# EAGLE design Nixie Radio (EAGLE 9.6.2)
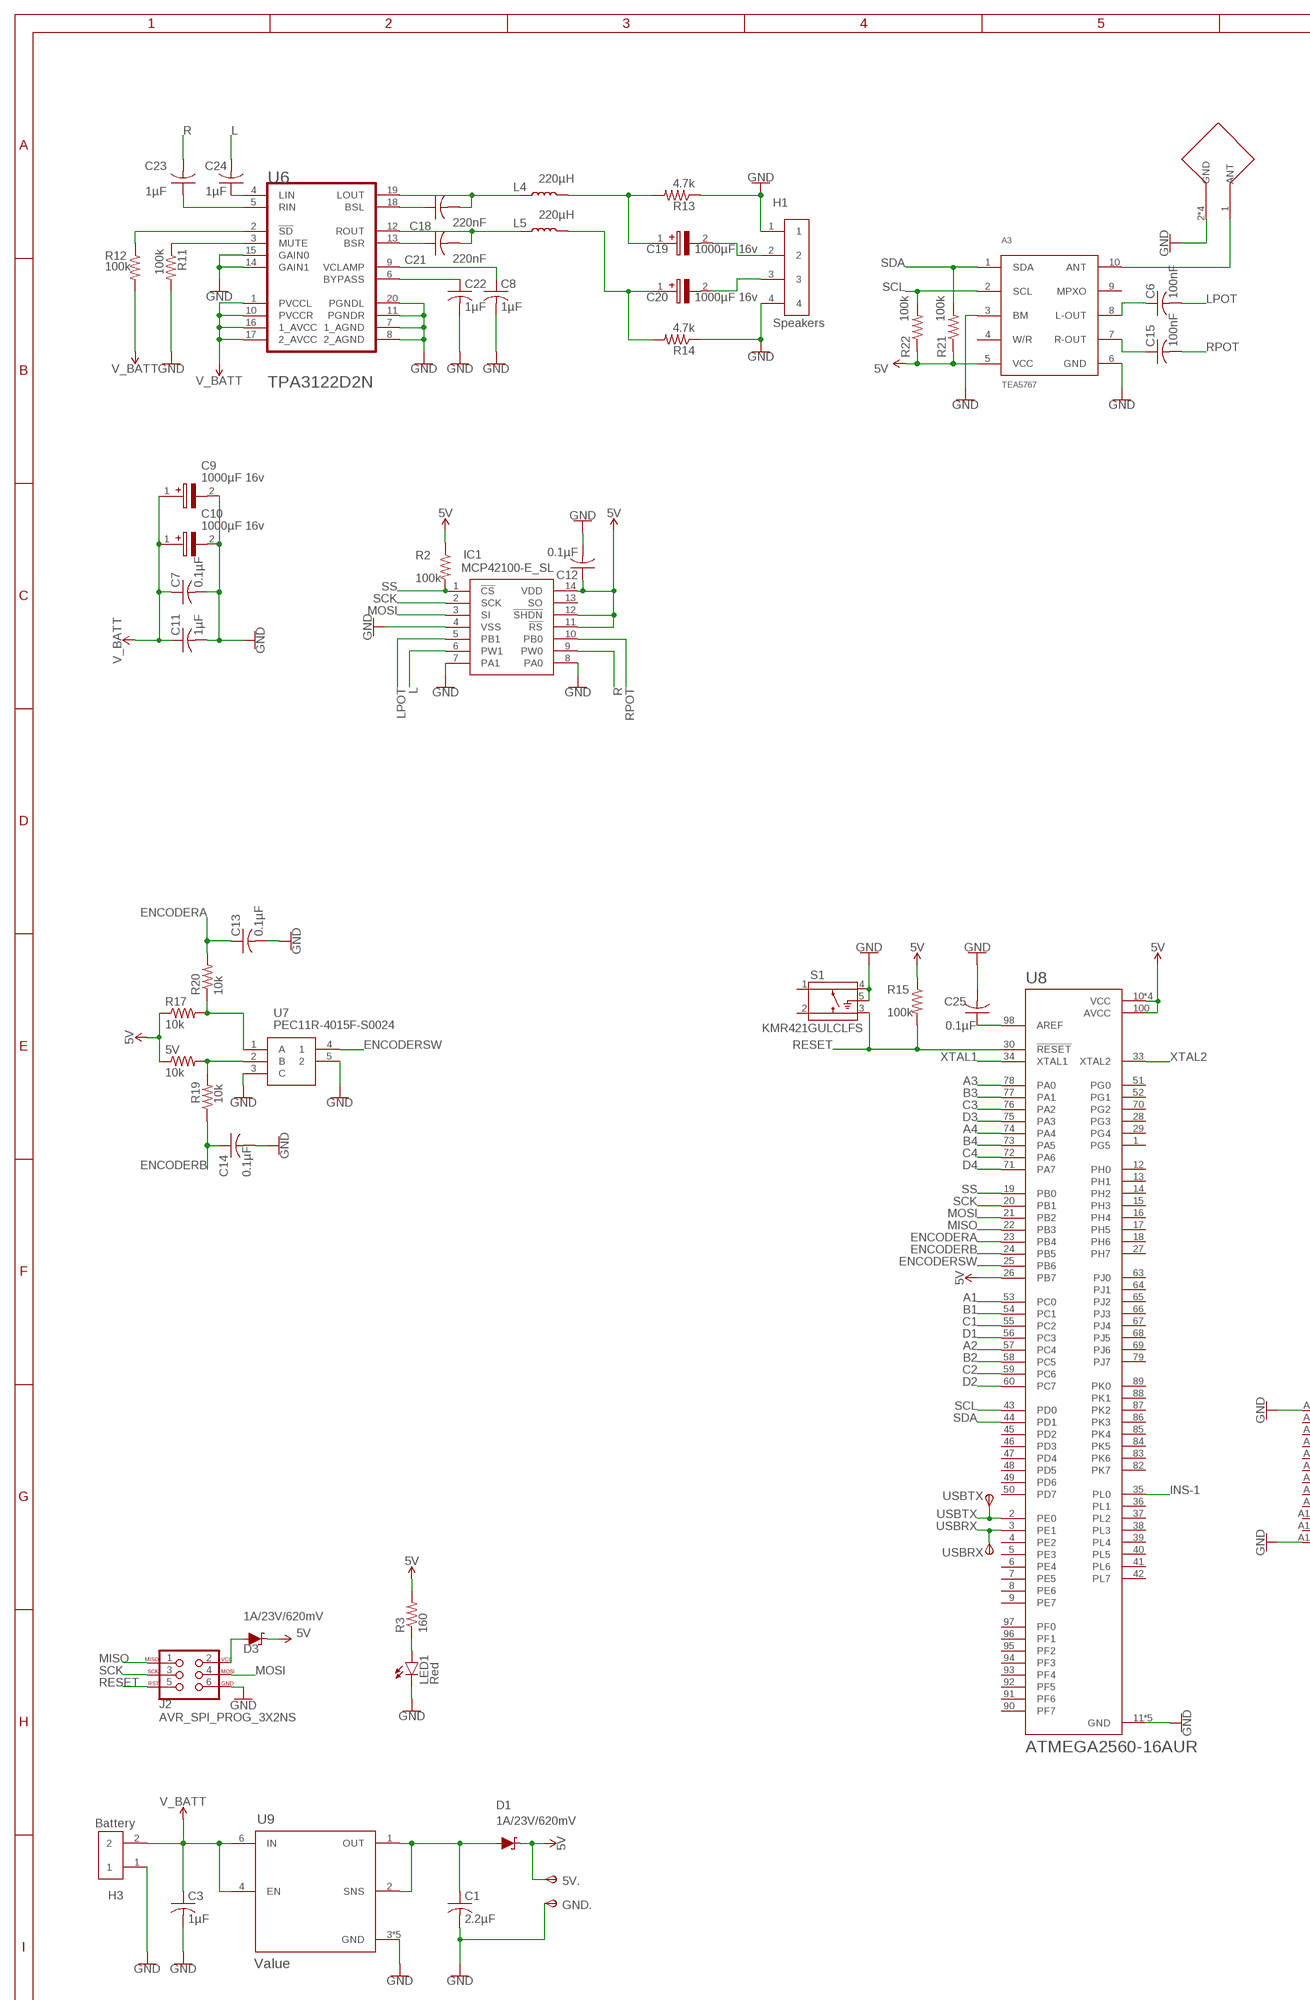
[diagram p0: schematic, sheet 1, part 1 of 2]
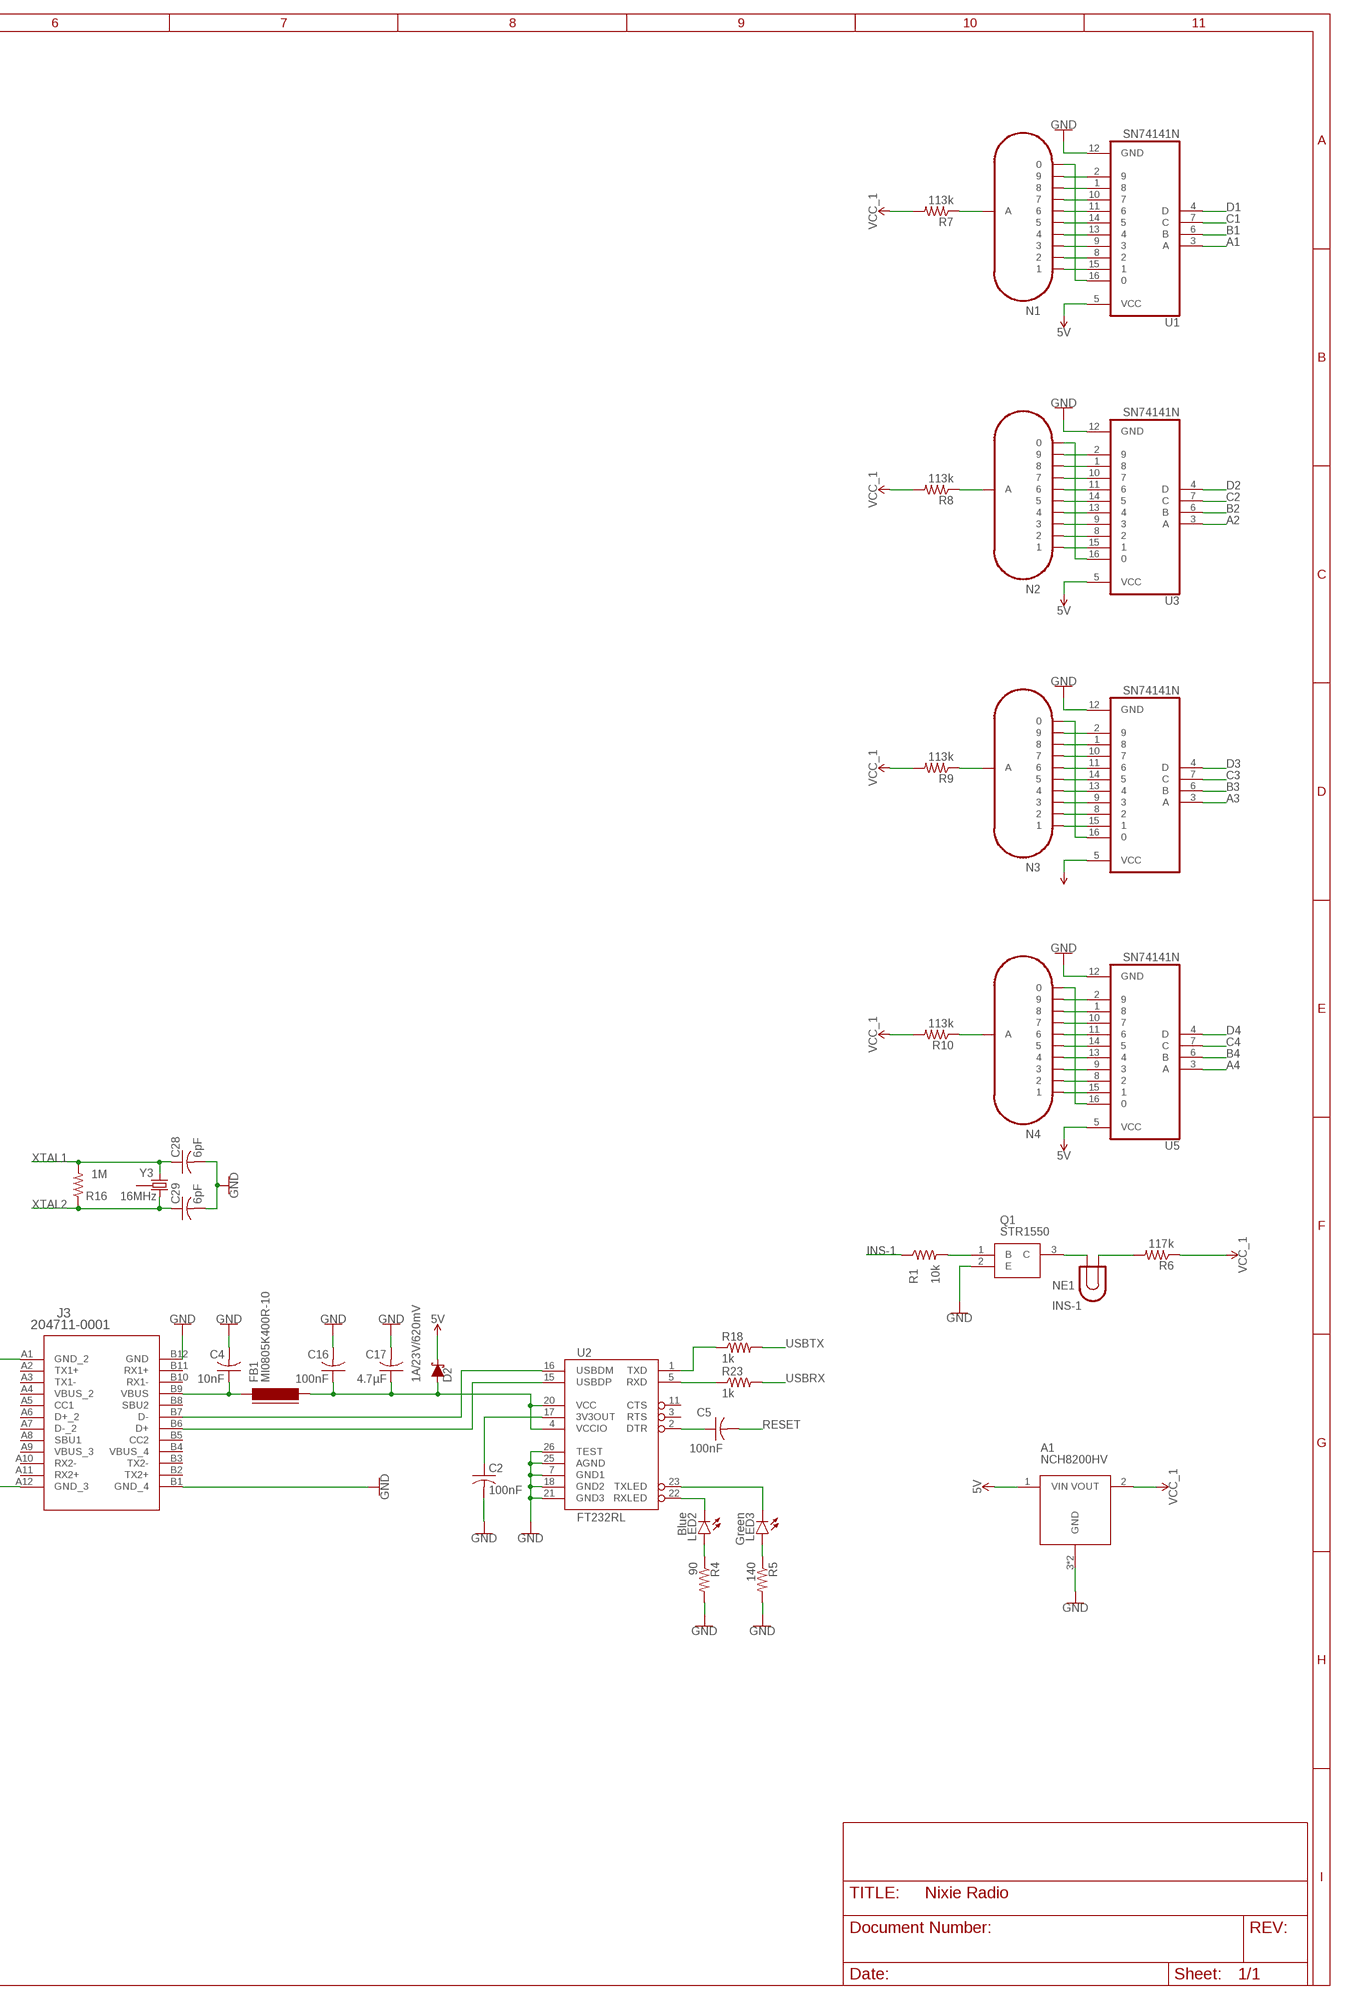
[diagram p1: schematic, sheet 1, part 2 of 2]

## Parts
5V  10k  R-US_M0805  [M0805]
5V.  TPSTP20R  [TP20R]
A1  NCH8200HV  [NCH8200HV]
A3  TEA5767  [TEA5767]
AE1  ANTENNA  RFPC-MMCX03-F  [RFPC-MMCX03-F]
C1  2.2µF  C-USC0805  [C0805]
C2  100nF  C-USC0805  [C0805]
C3  1µF  C-USC0805  [C0805]
C4  10nF  C-USC0805  [C0805]
C5  100nF  C-USC0805  [C0805]
C6  100nF  C-USC0805  [C0805]
C7  0.1µF  C-USC0805  [C0805]
C8  1µF  C-USC0805  [C0805]
C9  1000µF 16v  UCM1C102MNL1GS  [CAPAE1030X1080N]
C10  1000µF 16v  UCM1C102MNL1GS  [CAPAE1030X1080N]
C11  1µF  C-USC0805  [C0805]
C12  0.1µF  C-USC0805  [C0805]
C13  0.1µF  C-USC0805  [C0805]
C14  0.1µF  C-USC0805  [C0805]
C15  100nF  C-USC0805  [C0805]
C16  100nF  C-USC0805  [C0805]
C17  4.7µF  C-USC0805  [C0805]
C18  220nF  C-USC0805  [C0805]
C19  1000µF 16v  UCM1C102MNL1GS  [CAPAE1030X1080N]
C20  1000µF 16v  UCM1C102MNL1GS  [CAPAE1030X1080N]
C21  220nF  C-USC0805  [C0805]
C22  1µF  C-USC0805  [C0805]
C23  1µF  C-USC0805  [C0805]
C24  1µF  C-USC0805  [C0805]
C25  0.1µF  C-USC0805  [C0805]
C28  6pF  C-USC0805  [C0805]
C29  6pF  C-USC0805  [C0805]
D1  1A/23V/620mV  DIODE-SCHOTTKY-BAT20J  [SOD-323]
D2  1A/23V/620mV  DIODE-SCHOTTKY-BAT20J  [SOD-323]
D3  1A/23V/620mV  DIODE-SCHOTTKY-BAT20J  [SOD-323]
FB1  MI0805K400R-10  FERRITE-0805  [FB805]
GND.  TPSTP20R  [TP20R]
H1  Speakers  4_PAD_0.1"  [4_PAD_0.1"]
H3  Battery  2_PAD_0.1"  [2_PAD_0.1"]
IC1  MCP42100-E_SL  [SOIC127P600X175-14N]
J2  AVR_SPI_PROG_3X2NS  [2X3-NS]
J3  204711-0001  [204711-0001_MOL]
L4  220µH  0207ROUNDINDUCTOR  [0207ROUND]
L5  220µH  0207ROUNDINDUCTOR  [0207ROUND]
LED1  Red  LEDSML0805  [SML0805]
LED2  Blue  LEDSML0805  [SML0805]
LED3  Green  LEDSML0805  [SML0805]
N1  IN-17  [IN-17]
N2  IN-17  [IN-17]
N3  IN-17  [IN-17]
N4  IN-17  [IN-17]
NE1  INS-1  [INS-1]
Q1  STR1550  [SOT105P255X140-3N]
R1  10k  R-US_M0805  [M0805]
R2  100k  R-US_M0805  [M0805]
R3  160  R-US_M0805  [M0805]
R4  90  R-US_M0805  [M0805]
R5  140  R-US_M0805  [M0805]
R6  117k  R-US_M0805  [M0805]
R7  113k  R-US_M0805  [M0805]
R8  113k  R-US_M0805  [M0805]
R9  113k  R-US_M0805  [M0805]
R10  113k  R-US_M0805  [M0805]
R11  100k  R-US_M0805  [M0805]
R12  100k  R-US_M0805  [M0805]
R13  4.7k  R-US_M0805  [M0805]
R14  4.7k  R-US_M0805  [M0805]
R15  100k  R-US_M0805  [M0805]
R16  1M  R-US_M0805  [M0805]
R17  10k  R-US_M0805  [M0805]
R18  1k  R-US_M0805  [M0805]
R19  10k  R-US_M0805  [M0805]
R20  10k  R-US_M0805  [M0805]
R21  100k  R-US_M0805  [M0805]
R22  100k  R-US_M0805  [M0805]
R23  1k  R-US_M0805  [M0805]
S1  KMR421GULCLFS  [SW_KMR421GULCLFS]
U1  SN74141N  [DIP762W46P254L2134H508Q16]
U2  FT232RL  FT232RL-BASICSSOP  [SSOP28DB]
U3  SN74141N  [DIP762W46P254L2134H508Q16]
U4  SN74141N  [DIP762W46P254L2134H508Q16]
U5  SN74141N  [DIP762W46P254L2134H508Q16]
U6  TEXAS_INSTRUMENTS_TPA3122D2NTEXAS_INSTRUMENTS_TPA3122D2N_0_0  [TEXAS_INSTRUMENTS_TPA3122D2N_0]
U7  PEC11R-4015F-S0024  [PEC12R-4XXXF-SXXXX_1]
U8  ATMEGA2560-16AUR  [QFP50P1600X1600X120-100N]
U9  Value  TLV76750DRVTDRV0006A_NV  [6-WSON]
USBRX  TPSTP20R  [TP20R]
USBTX  TPSTP20R  [TP20R]
Y3  16MHz  CRYSTAL-16MHZ_SMALL  [CRYSTAL-SMD-2X2.5MM]

## Nets
5V: 5V.1 5V..TP(PP) A1.1(VIN) A3.5(VCC) C12.1 D1.C D2.C D3.C IC1.11(!RS) IC1.12(!SHDN) IC1.14(VDD) R2.1 R3.2 R15.1 R17.1 R21.1 R22.1 U1.5(VCC) U3.5(VCC) U4.5(VCC) U5.5(VCC) U8.10(VCC) U8.26(PB7) U8.31(VCC) U8.61(VCC) U8.80(VCC) U8.100(AVCC)
A1: U1.3(A) U8.53(PC0)
A2: U3.3(A) U8.57(PC4)
A3: U4.3(A) U8.78(PA0)
A4: U5.3(A) U8.74(PA4)
B1: U1.6(B) U8.54(PC1)
B2: U3.6(B) U8.58(PC5)
B3: U4.6(B) U8.77(PA1)
B4: U5.6(B) U8.73(PA5)
C1: U1.7(C) U8.55(PC2)
C2: U3.7(C) U8.59(PC6)
C3: U4.7(C) U8.76(PA2)
C4: U5.7(C) U8.72(PA6)
D1: U1.4(D) U8.56(PC3)
D2: U3.4(D) U8.60(PC7)
D3: U4.4(D) U8.75(PA3)
D4: U5.4(D) U8.71(PA7)
ENCODERA: C13.1 R20.2 U8.23(PB4)
ENCODERB: C14.1 R19.1 U8.24(PB5)
ENCODERSW: U7.4 U8.25(PB6)
GND: A1.3(GND) A1.4(GND) A3.3(BM) A3.6(GND) AE1.2(GND) AE1.3(GND) AE1.4(GND) AE1.5(GND) C1.2 C2.2 C3.2 C4.2 C7.2 C8.2 C9.2(-) C10.2(-) C11.2 C12.2 C13.2 C14.2 C16.2 C17.2 C22.2 C25.2 C28.2 C29.2 GND..TP(PP) H1.1 H1.4 H3.1 IC1.4(VSS) IC1.7(PA1) IC1.8(PA0) J2.6 J3.A1(GND_2) J3.A12(GND_3) J3.B1(GND_4) J3.B12(GND) LED1.C Q1.2(E) R4.2 R5.2 R11.2 R13.1 R14.1 S1.4 S1.5(G) U1.12(GND) U2.7(GND1) U2.18(GND2) U2.21(GND3) U2.25(AGND) U2.26(TEST) U3.12(GND) U4.12(GND) U5.12(GND) U6.7(1_AGND) U6.8(2_AGND) U6.11(PGNDR) U6.14(GAIN1) U6.15(GAIN0) U6.20(PGNDL) U7.3(C) U7.5 U8.11(GND) U8.32(GND) U8.62(GND) U8.81(GND) U8.99(GND) U9.3(GND) U9.5(GND) U9.7(GND) U9.8(GND) U9.9(GND)
INS-1: R1.1 U8.35(PL0)
L: C24.2 IC1.6(PW1)
LPOT: C6.2 IC1.5(PB1)
MISO: J2.1 U8.22(PB3)
MOSI: IC1.3(SI) J2.4 U8.21(PB2)
N$1: C4.1 FB1.1 J3.B9(VBUS)
N$2 [170v]: NE1.2 Q1.3(C)
N$3 [170v]: NE1.1 R6.2
N$4: C5.1 U2.2(DTR)
N$5: C2.1 U2.17(3V3OUT)
N$6: LED1.A R3.1
N$7: C16.1 C17.1 D2.A FB1.2 U2.4(VCCIO) U2.20(VCC)
N$8: C1.1 D1.A U9.1(OUT) U9.2(SNS)
N$9 [170v]: Q1.1(B) R1.2
N$10 [170v]: N1.1 U1.15
N$11: J3.B6(D+) U2.15(USBDP)
N$12: J3.B7(D-) U2.16(USBDM)
N$13: R18.1 U2.1(TXD)
N$14 [170v]: N1.2 U1.8
N$15 [170v]: N1.3 U1.9
N$16 [170v]: N1.4 U1.13
N$17 [170v]: N1.5 U1.14
N$18 [170v]: N1.6 U1.11
N$19 [170v]: N1.7 U1.10
N$20 [170v]: N1.8 U1.1
N$21 [170v]: N1.9 U1.2
N$22 [170v]: N1.0 U1.16
N$23 [170v]: N1.A R7.1
N$24 [170v]: N2.1 U3.15
N$25 [170v]: N2.2 U3.8
N$26 [170v]: N2.3 U3.9
N$27 [170v]: N2.4 U3.13
N$28 [170v]: N2.5 U3.14
N$29 [170v]: N2.6 U3.11
N$30 [170v]: N2.7 U3.10
N$31 [170v]: N2.8 U3.1
N$32 [170v]: N2.9 U3.2
N$33 [170v]: N2.0 U3.16
N$34 [170v]: N2.A R8.1
N$35 [170v]: N3.1 U4.15
N$36 [170v]: N3.2 U4.8
N$37 [170v]: N3.3 U4.9
N$38 [170v]: N3.4 U4.13
N$39 [170v]: N3.5 U4.14
N$40 [170v]: N3.6 U4.11
N$41 [170v]: N3.7 U4.10
N$42 [170v]: N3.8 U4.1
N$43 [170v]: N3.9 U4.2
N$44 [170v]: N3.0 U4.16
N$45 [170v]: N3.A R9.1
N$46 [170v]: N4.1 U5.15
N$47 [170v]: N4.2 U5.8
N$48 [170v]: N4.3 U5.9
N$49 [170v]: N4.4 U5.13
N$50 [170v]: N4.5 U5.14
N$51 [170v]: N4.6 U5.11
N$52 [170v]: N4.7 U5.10
N$53 [170v]: N4.8 U5.1
N$54 [170v]: N4.9 U5.2
N$55 [170v]: N4.0 U5.16
N$56 [170v]: N4.A R10.1
N$57: LED2.A R4.1
N$58: C8.1 U6.9(VCLAMP)
N$59: A3.10(ANT) AE1.1(ANT)
N$60: R11.1 U6.3(MUTE)
N$61: R12.1 U6.2(!SD!)
N$62: R23.1 U2.5(RXD)
N$63 [Speakers]: C18.2 L4.1 U6.19(LOUT)
N$64: C18.1 U6.18(BSL)
N$65 [Speakers]: C19.2(-) H1.2
N$66 [Speakers]: C20.1(+) L5.2 R14.2
N$67 [Speakers]: C20.2(-) H1.3
N$68: C21.1 U6.13(BSR)
N$69: LED2.C U2.22(RXLED)
N$70: C22.1 U6.6(BYPASS)
N$71: C23.1 U6.5(RIN)
N$72: C24.1 U6.4(LIN)
N$73 [Speakers]: C19.1(+) L4.2 R13.2
N$74 [Speakers]: C21.2 L5.1 U6.12(ROUT)
N$75: LED3.C U2.23(TXLED)
N$76: C25.1 U8.98(AREF)
N$78: R17.2 R20.1 U7.1(A)
N$79: LED3.A R5.1
N$80: 5V.2 R19.2 U7.2(B)
N$83: A3.8(L-OUT) C6.1
N$84: A3.7(R-OUT) C15.1
N$85: D3.A J2.2
R: C23.2 IC1.9(PW0)
RESET: C5.2 J2.5 R15.2 S1.3 U8.30(!RESET)
RPOT: C15.2 IC1.10(PB0)
SCK: IC1.2(SCK) J2.3 U8.20(PB1)
SCL: A3.2(SCL) R22.2 U8.43(PD0)
SDA: A3.1(SDA) R21.2 U8.44(PD1)
SS: IC1.1(!CS) R2.2 U8.19(PB0)
USBRX: R23.2 U8.3(PE1) USBRX.TP(PP)
USBTX: R18.2 U8.2(PE0) USBTX.TP(PP)
V_BATT: C3.1 C7.1 C9.1(+) C10.1(+) C11.1 H3.2 R12.2 U6.1(PVCCL) U6.10(PVCCR) U6.16(1_AVCC) U6.17(2_AVCC) U9.4(EN) U9.6(IN)
VCC_1 [170v]: A1.2(VOUT) R6.1 R7.2 R8.2 R9.2 R10.2
XTAL1: C28.1 R16.2 U8.34(XTAL1) Y3.P1
XTAL2: C29.1 R16.1 U8.33(XTAL2) Y3.P3
Unconnected: A3.4(W/R) A3.9(MPXO) IC1.13(SO) J3.A2(TX1+) J3.A3(TX1-) J3.A5(CC1) J3.A6(D+_2) J3.A7(D-_2) J3.A8(SBU1) J3.A10(RX2-) J3.A11(RX2+) J3.B2(TX2+) J3.B3(TX2-) J3.B5(CC2) J3.B8(SBU2) J3.B10(RX1-) J3.B11(RX1+) S1.1 S1.2 U2.3(RTS) U2.11(CTS) U8.1(PG5) U8.4(PE2) U8.5(PE3) U8.6(PE4) U8.7(PE5) U8.8(PE6) U8.9(PE7) U8.12(PH0) U8.13(PH1) U8.14(PH2) U8.15(PH3) U8.16(PH4) U8.17(PH5) U8.18(PH6) U8.27(PH7) U8.28(PG3) U8.29(PG4) U8.36(PL1) U8.37(PL2) U8.38(PL3) U8.39(PL4) U8.40(PL5) U8.41(PL6) U8.42(PL7) U8.45(PD2) U8.46(PD3) U8.47(PD4) U8.48(PD5) U8.49(PD6) U8.50(PD7) U8.51(PG0) U8.52(PG1) U8.63(PJ0) U8.64(PJ1) U8.65(PJ2) U8.66(PJ3) U8.67(PJ4) U8.68(PJ5) U8.69(PJ6) U8.70(PG2) U8.79(PJ7) U8.82(PK7) U8.83(PK6) U8.84(PK5) U8.85(PK4) U8.86(PK3) U8.87(PK2) U8.88(PK1) U8.89(PK0) U8.90(PF7) U8.91(PF6) U8.92(PF5) U8.93(PF4) U8.94(PF3) U8.95(PF2) U8.96(PF1) U8.97(PF0)

## Power pins joined to a net without a drawn wire
GND: Y3.P2(GND) Y3.P4(GND)
VBUS_2: J3.A4(VBUS_2)
VBUS_3: J3.A9(VBUS_3)
VBUS_4: J3.B4(VBUS_4)

## Library data of the parts
5V R1-R23 = rcl:R-US_: RESISTOR, American symbol; SPICEPREFIX: R
5V. GND. USBRX USBTX = testpad:TPS: TEST PIN
A1 = Custom:NCH8200HV: NCH8200HV High Voltage DC Power Supply for Nixie Tubes 2.7-5.0v input 170v output 30mA peak at 5v input
A3 = Custom:TEA5767
AE1 = Custom:RFPC-MMCX03-F
C1-C8 C11-C18 C21-C25 C28 C29 = rcl:C-US: CAPACITOR, American symbol; SPICEPREFIX: C
C9 C10 C19 C20 = SamacSys_Parts:UCM1C102MNL1GS: Nichicon 1000uF 16 V Aluminium Electrolytic Capacitor SMD, CM Series 2000h 10 (Dia.) x 10mm Source: Datasheet <http://nichicon-us.com/english/products/pdfs/e-ucm.pdf>; ARROW_PART_NUMBER: UCM1C102MNL1GS; ARROW_PRICE-STOCK: https://www.arrow.com/en/products/ucm1c102mnl1gs/nichicon; DESCRIPTION: Nichicon 1000uF 16 V Aluminium Electrolytic Capacitor SMD, CM Series 2000h 10 (Dia.) x 10mm; HEIGHT: 10.8mm; MANUFACTURER_NAME: Nichicon; MANUFACTURER_PART_NUMBER: UCM1C102MNL1GS; MOUSER_PART_NUMBER: 647-UCM1C102MNL1GS; MOUSER_PRICE-STOCK: https://www.mouser.co.uk/ProductDetail/Nichicon/UCM1C102MNL1GS?qs=DSgADHjnLTngCcixL%252BdiNw%3D%3D
D1-D3 = SparkFun-DiscreteSemi:DIODE-SCHOTTKY: Schottky diode A Schottky diode is a semiconductor diode which has a low forward voltage drop and a very fast switching action.; PROD_ID: DIO-11623
FB1 = dp_devices.v6:FERRITE: Ferrite bead in various packages
H1 = Custom:4_PAD_0.1"
H3 = Custom:2_PAD_0.1"
IC1 = SamacSys_Parts:MCP42100-E_SL: Dig Pot,256st,SPI,100k,2ch,MCP42100-E/SL Source: Datasheet <http://docs-emea.rs-online.com/webdocs/0a88/0900766b80a8815c.pdf>; ARROW_PART_NUMBER: MCP42100-E/SL; ARROW_PRICE-STOCK: https://www.arrow.com/en/products/mcp42100-esl/microchip-technology; DESCRIPTION: Dig Pot,256st,SPI,100k,2ch,MCP42100-E/SL; HEIGHT: 1.75mm; MANUFACTURER_NAME: Microchip; MANUFACTURER_PART_NUMBER: MCP42100-E/SL; MOUSER_PART_NUMBER: 579-MCP42100-E/SL; MOUSER_PRICE-STOCK: https://www.mouser.co.uk/ProductDetail/Microchip-Technology/MCP42100-E-SL?qs=cQYLKLPzRJkzjV2J8NBddg%3D%3D
J2 = SparkFun-Connectors:AVR_SPI_PROG_3X2: AVR ISP 6 Pin This is the reduced ISP connector for AVR programming. Common on Arduino. This footprint will take up less PCB space and can be used with a 10-pin to 6-pin adapter such as SKU: BOB-08508 **Special note about "TEST_POINT" package. The stop mask is on the top side, so if you want your programming test points to be on the bottom of your board, make sure to place this package on the bottom side of the board. This also ensure that the orientation to program from the bottom side will be correct. SparkFun Products: SparkFun ISP Pogo Adapter <https://www.sparkfun.com/products/11591> - NS Tiny AVR Programmer <https://www.sparkfun.com/products/11801> -PTH
J3 = Custom:204711-0001; BUILT_BY: EMA_Cory; COPYRIGHT: Copyright (C) 2018 Accelerated Designs. All rights reserved; DATASHEET: https://www.molex.com/pdm_docs/sd/2047110001_sd.pdf; MANUFACTURER_PART_NUMBER: 204711-0001; SOURCELIBRARY: Molex_2020-03-12; VENDOR: Molex Connector Corporation
L4 L5 = Custom:0207ROUNDINDUCTOR
LED1-LED3 = led:LED: LED OSRAM: - CHIPLED LG R971, LG N971, LY N971, LG Q971, LY Q971, LO R971, LY R971 LH N974, LH R974 LS Q976, LO Q976, LY Q976 LO Q996 - Hyper CHIPLED LW Q18S LB Q993, LB Q99A, LB R99A - SideLED LS A670, LO A670, LY A670, LG A670, LP A670 LB A673, LV A673, LT A673, LW A673 LH A674 LY A675 LS A676, LA A676, LO A676, LY A676, LW A676 LS A679, LY A679, LG A679 - Hyper Micro SIDELED® LS Y876, LA Y876, LO Y876, LY Y876 LT Y87S - SmartLED LW L88C, LW L88S LB L89C, LB L89S, LG L890 LS L89K, LO L89K, LY L89K LS L896, LA L896, LO L896, LY L896 - TOPLED LS T670, LO T670, LY T670, LG T670, LP T670 LSG T670, LSP T670, LSY T670, LOP T670, LYG T670 LG T671, LOG T671, LSG T671 LB T673, LV T673, LT T673, LW T673 LH T674 LS T676, LA T676, LO T676, LY T676, LB T676, LH T676, LSB T676, LW T676 LB T67C, LV T67C, LT T67C, LS T67K, LO T67K, LY T67K, LW E67C LS E67B, LA E67B, LO E67B, LY E67B, LB E67C, LV E67C, LT E67C LW T67C LS T679, LY T679, LG T679 LS T770, LO T770, LY T770, LG T770, LP T770 LB T773, LV T773, LT T773, LW T773 LH T774 LS E675, LA E675, LY E675, LS T675 LS T776, LA T776, LO T776, LY T776, LB T776 LHGB T686 LT T68C, LB T68C - Hyper Mini TOPLED® LB M676 - Mini TOPLED Santana® LG M470 LS M47K, LO M47K, LY M47K Source: http://www.osram.convergy.de LUXEON: - LUMILED® LXK2-PW12-R00, LXK2-PW12-S00, LXK2-PW14-U00, LXK2-PW14-V00 LXK2-PM12-R00, LXK2-PM12-S00, LXK2-PM14-U00 LXK2-PE12-Q00, LXK2-PE12-R00, LXK2-PE12-S00, LXK2-PE14-T00, LXK2-PE14-U00 LXK2-PB12-K00, LXK2-PB12-L00, LXK2-PB12-M00, LXK2-PB14-N00, LXK2-PB14-P00, LXK2-PB14-Q00 LXK2-PR12-L00, LXK2-PR12-M00, LXK2-PR14-Q00, LXK2-PR14-R00 LXK2-PD12-Q00, LXK2-PD12-R00, LXK2-PD12-S00 LXK2-PH12-R00, LXK2-PH12-S00 LXK2-PL12-P00, LXK2-PL12-Q00, LXK2-PL12-R00 Source: www.luxeon.com KINGBRIGHT: KA-3528ASYC Source: www.kingbright.com
N1-N4 = russian-nixies:IN-17: IN-17: tiny numeric topview nixie tube
NE1 = Custom:INS-1
Q1 = SamacSys_Parts:STR1550: Source: Datasheet <http://www.st.com/web/en/resource/technical/document/datasheet/DM00040355.pdf>; ARROW_PART_NUMBER: STR1550; ARROW_PRICE-STOCK: https://www.arrow.com/en/products/str1550/stmicroelectronics; HEIGHT: 1.4mm; MANUFACTURER_NAME: STMicroelectronics; MANUFACTURER_PART_NUMBER: STR1550; MOUSER_PART_NUMBER: 511-STR1550; MOUSER_PRICE-STOCK: https://www.mouser.co.uk/ProductDetail/STMicroelectronics/STR1550?qs=EkbspN8Z2F2apJ0fiM8dcA%3D%3D
S1 = KMR421GULCLFS:KMR421GULCLFS: Switch Tactile N.O. SPST Round Button Gull Wing 0.05A 32VDC 1VA 200000Cycles 2N SMD Automotive T/R; DESCRIPTION: Tactile Switch SPST-NO Top Actuated Surface Mount; DIGI-KEY_PART_NUMBER: CKN12152CT-ND; MF: C&K; MP: KMR421GULCLFS; PACKAGE: None; PURCHASE-URL: https://pricing.snapeda.com/search/part/KMR421GULCLFS/?ref=eda
U1 U3-U5 = SN74141N:SN74141N: BCD to DECIMAL Decoder/Driver; AVAILABILITY: Unavailable; MF: Texas Instruments; MP: SN74141N; PACKAGE: None; PRICE: None
U2 = SparkFun-IC-Comms:FT232RL-BASIC: FT232RL USB UART This is the simplified version of the FT232RL unit. Only what you need, nothing you don't. FT232RL 4th Generation USB UART (USB <-> Serial) Controller. Datasheet <http://www.sparkfun.com/datasheets/IC/FT232R_v104.pdf> SparkFun Products Component <https://www.sparkfun.com/products/650> (COM-00650) SparkFun RedBot Mainboard <https://www.sparkfun.com/products/12097> (ROB-12097) SparkFun FTDI Basic Breakout - 5V <https://www.sparkfun.com/products/9716> (DEV-09716) SparkFun FTDI Basic Breakout - 3.3V <https://www.sparkfun.com/products/9873> (DEV-09873) Bus Pirate - v3.6a <https://www.sparkfun.com/products/12942> (TOL-12942) SparkFun USB to Serial Breakout - FT232RL <https://www.sparkfun.com/products/12731> (BOB-12731) SparkFun PicoBoard <https://www.sparkfun.com/products/11888> (WIG-11888) SparkFun RFID USB Reader <https://www.sparkfun.com/products/9963> (SEN-09963) LilyPad FTDI Basic Breakout - 5V <https://www.sparkfun.com/products/10275> (DEV-10275) SparkFun Stepoko <https://www.sparkfun.com/products/13899> (ROB-13899); PROD_ID: IC-00870
U6 = Texas Instruments - TPA3122D2N:TEXAS_INSTRUMENTS_TPA3122D2N: TI-TPA312XD2N20; ANALOG_SUPPLY_MAX_V: 30; ANALOG_SUPPLY_MIN_V: 10; CIIVA_IDS: 1152231; CODE__JEDEC: MS-001; COMPONENT_LINK_1_DESCRIPTION: Manufacturer URL; COMPONENT_LINK_1_URL: http://www.ti.com/; COMPONENT_LINK_3_DESCRIPTION: Package Specification; COMPONENT_LINK_3_URL: http://www.ti.com/lit/ml/mpdi002c/mpdi002c.pdf; DATASHEET: http://www.ti.com/general/docs/lit/getliterature.tsp?genericPartNumber=TPA3122D2&fileType=pdf; DATASHEET_VERSION: SLOS527A; FOOTPRINT_VARIANT_NAME_0: Manufacturer Recommended; IMPORTED: yes; IMPORTED_FROM: vault; IMPORT_TS: 1521869305; INPUT_TYPE: Analog; MAX_NUMBER_OF_SPEAKER_OUTPUTS: 2; MF: Texas Instruments; MOUNTING_TECHNOLOGY: Through Hole; MPN: TPA3122D2N; PACKAGE: N20; PACKAGE_DESCRIPTION: 20-Pin Plastic In-Line, Body 25.40 x 6.35 mm, Pitch 2.54 mm; PACKAGE_VERSION: 4040049/E, 12/2002; POWER_STAGE_SUPPLY_MINV: 10; PREFIX: U; RELEASE_DATE: 1402290933; ROHS: Yes; SUB_FAMILY: Mid/High-Power Amplifier; VAULT_GUID: DBB3EB4B-1E56-4A26-B153-60ECF3818500; VAULT_REVISION: 8AC7F0CA-F56F-472F-9EDD-37D54B4B592A
U7 = SamacSys_Parts:PEC11R-4015F-S0024: Bourns 24 Pulse Incremental Mechanical Rotary Encoder with a 6 mm Flat Shaft (Not Indexed), Through Hole Source: Datasheet <https://www.bourns.com/docs/Product-Datasheets/pec11R.pdf>; ARROW_PART_NUMBER: PEC11R-4015F-S0024; ARROW_PRICE-STOCK: https://www.arrow.com/en/products/pec11r-4015f-s0024/bourns; DESCRIPTION: Bourns 24 Pulse Incremental Mechanical Rotary Encoder with a 6 mm Flat Shaft (Not Indexed), Through Hole; HEIGHT: mm; MANUFACTURER_NAME: Bourns; MANUFACTURER_PART_NUMBER: PEC11R-4015F-S0024; MOUSER_PART_NUMBER: 652-PEC11R-4015F-S24; MOUSER_PRICE-STOCK: https://www.mouser.co.uk/ProductDetail/Bourns/PEC11R-4015F-S0024?qs=Zq5ylnUbLm4l0nvCUCX4Xw%3D%3D
U8 = ATMEGA2560-16AUR:ATMEGA2560-16AUR: ATmega Series 16 MHz 256 KB Flash 8 KB SRAM 8-Bit Microcontroller - TQFP-100; DESCRIPTION: AVR AVR® ATmega Microcontroller IC 8-Bit 16MHz 256KB (128K x 16) FLASH 100-TQFP (14x14); DIGI-KEY_PART_NUMBER: ATMEGA2560-16AURCT-ND; MF: Microchip; MP: ATMEGA2560-16AUR; PACKAGE: TQFP-100 Microchip
U9 = Custom:TLV76750DRVT; MANUFACTURER: Texas Instruments; PARTNUMBER: TLV76701DRVR; REFDES: RefDes; TYPE: TYPE
Y3 = SparkFun-Clocks:CRYSTAL-16MHZ_SMALL: 16 MHz Crystal Digikey Link <https://www.digikey.com/product-detail/en/epson/FA-20H-16.0000MF10Z-AJ5/SER4201TR-ND/7430936> Crystal Attributes: Frequency: 16 MHz Frequency Stability: +/- 10ppm Frequency Tolerance: +/- 10ppm Load Capacitance: 8pF ESR: 80 Ohms Operating Mode: Fundamental PAD 2 and PAD 4 are GROUNDED; PROD_ID: XTAL-14664

## Net classes
1 Speakers: width 0.457 mm
2 AmpPower: width 0.686 mm

## Board
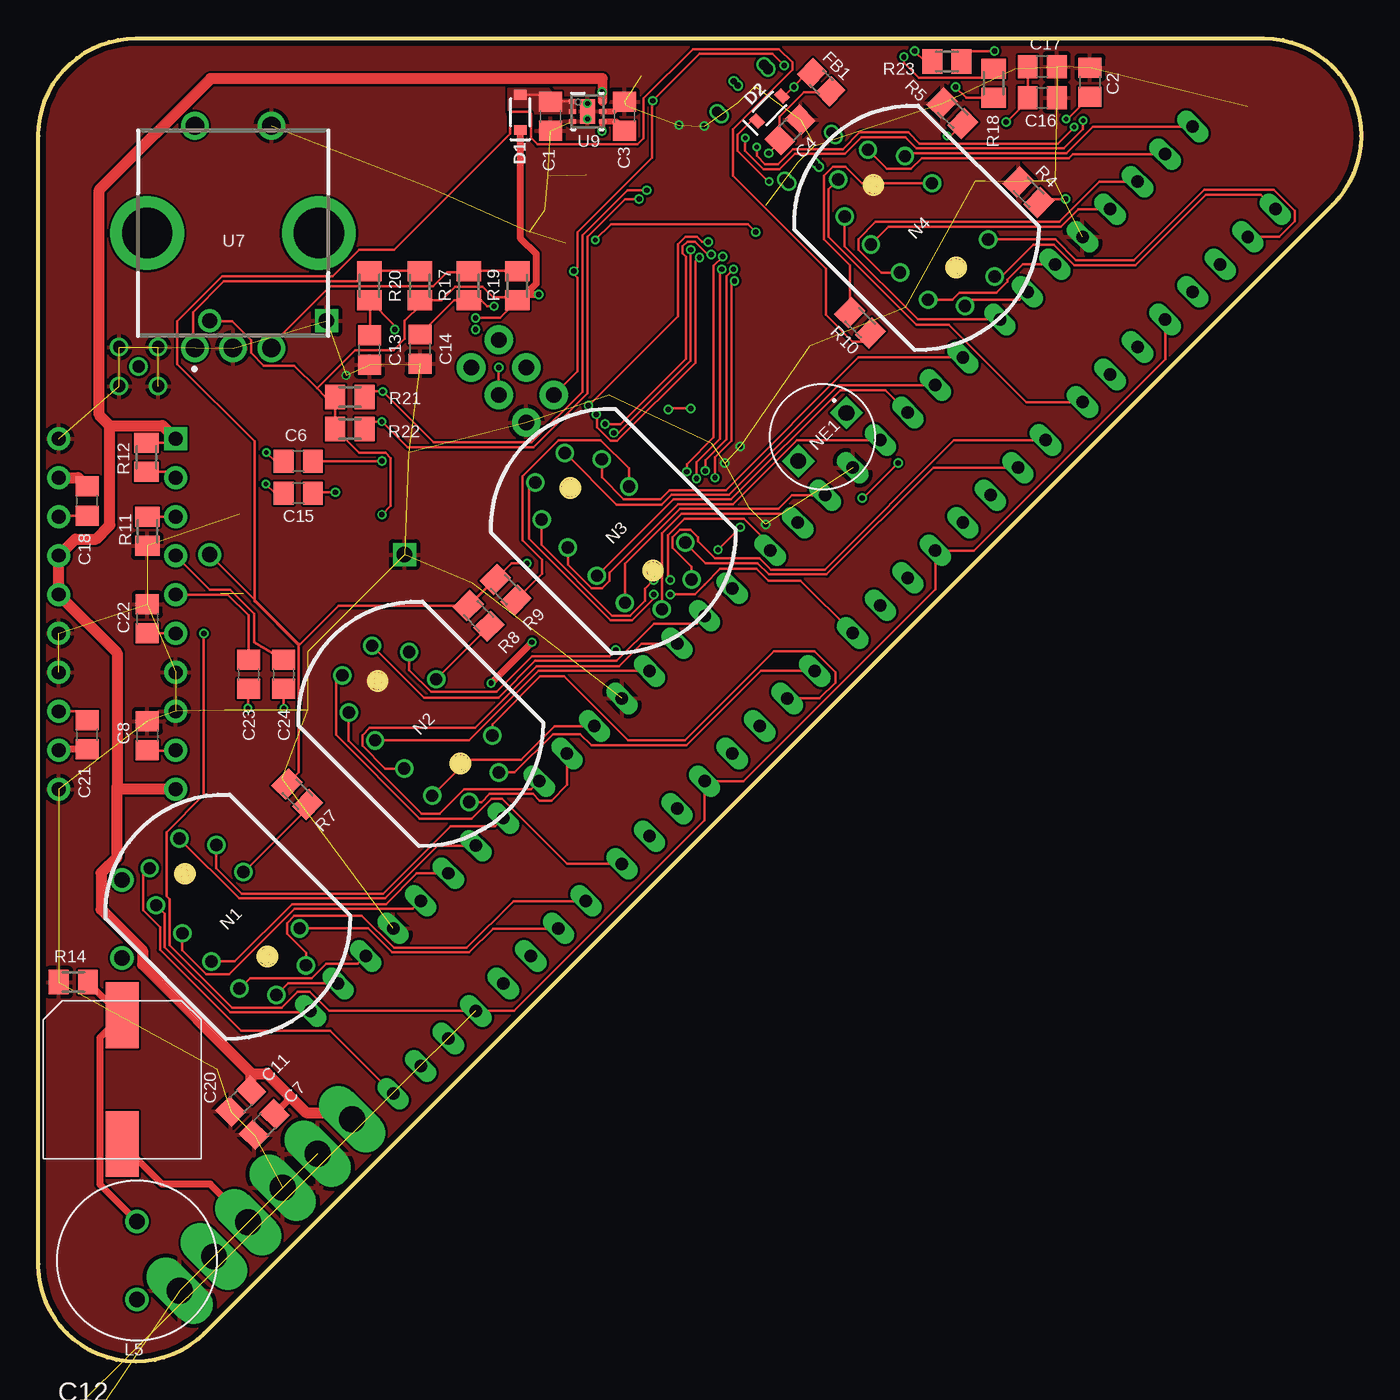
[diagram p2: board, top side]
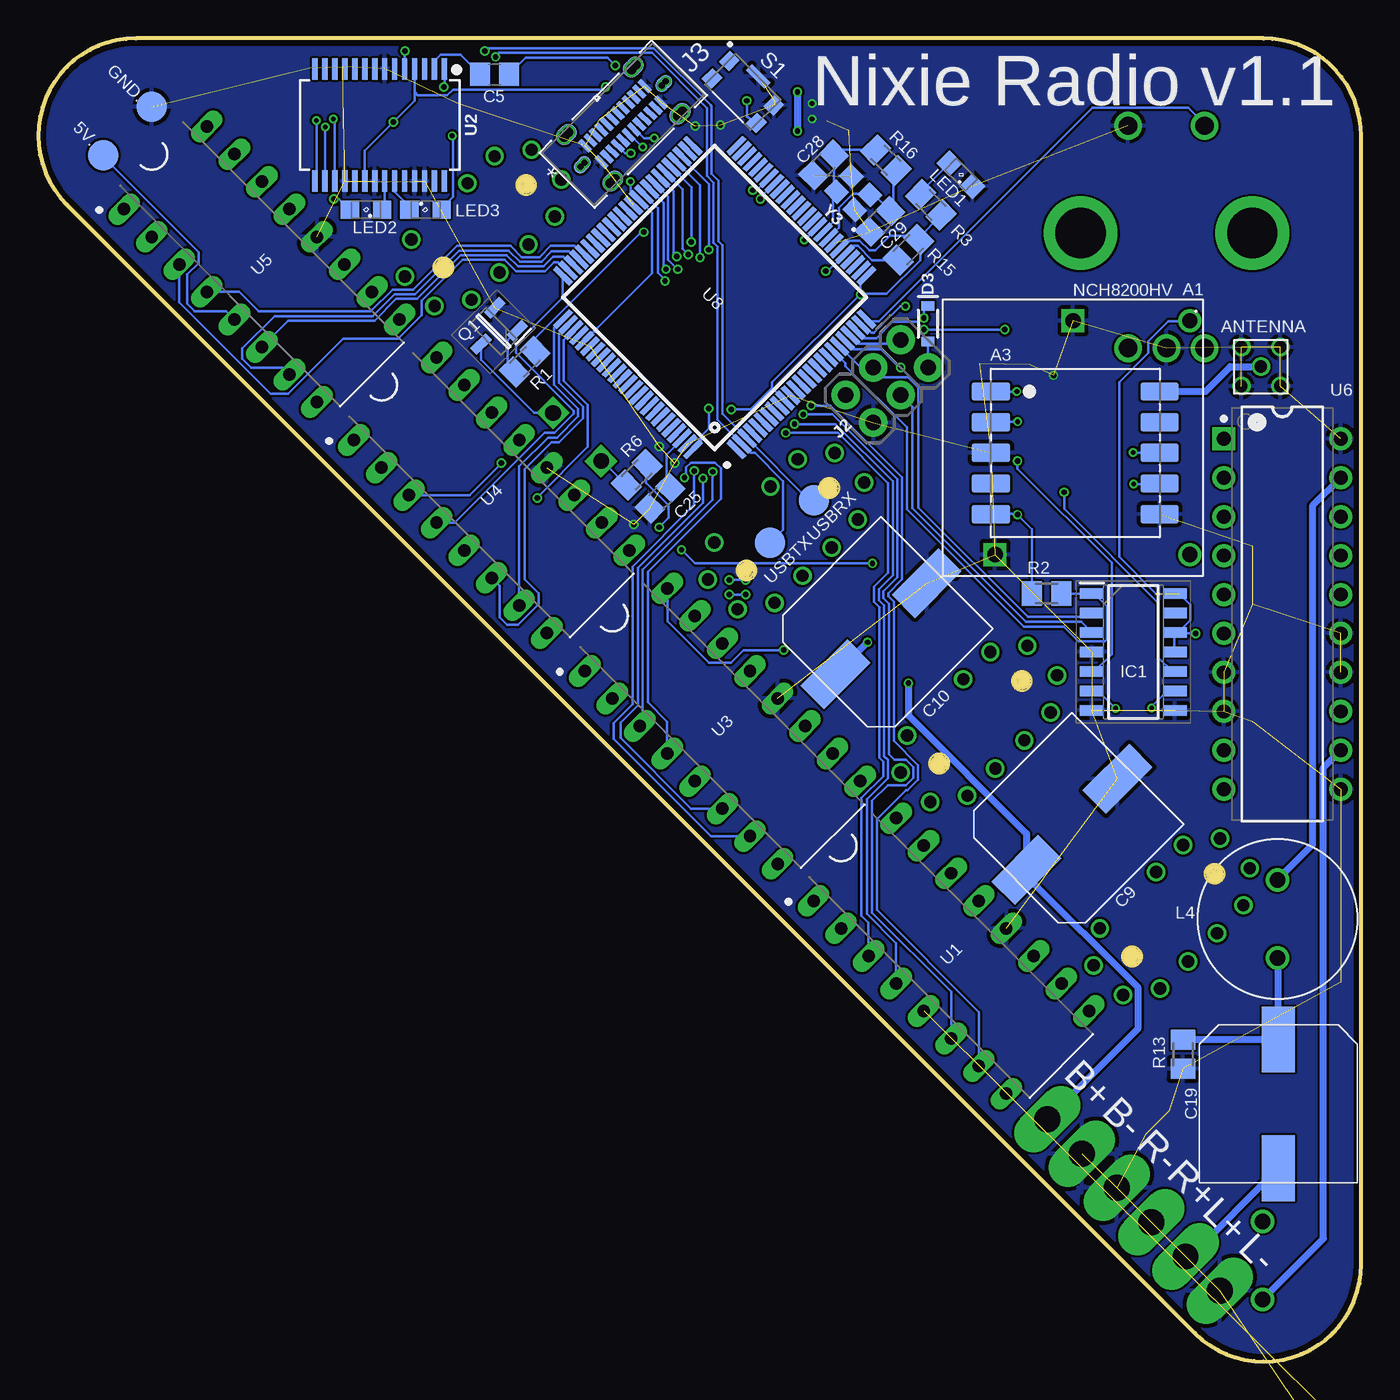
[diagram p3: board, bottom side, seen from below]

Size 86.27 x 86.27 mm. Coordinates in mm from the lower left corner, seen from the top.
Outline: 0,79.92 arc-90 6.35,86.27 79.92,86.27 arc-135 84.41,75.43 10.84,1.86 arc-135 0,6.35 0,79.92
Copper layers (1*16): Top 0.035559375mm / dielectric 1.6mm / Bottom 0.035559375mm
Design rules "SeedStudio_2_Layer_Cheap": minimum track width 6mil, minimum drill 0.3mm, track to track 6mil, track to pad 6mil, pad to pad 6mil, via to via 6mil, smd to smd 6mil, copper to edge 15mil, drill to drill 6mil, minimum pad ring 5mil, minimum via ring 5mil, stop-mask expansion 2.5mil, vias tented up to drill 0mil, thermal gap 10mil

### Footprints (pad centres in the part's own frame; a part is rotated, then mirrored left to right if it is on the bottom)
M0805 = smd 1.3 x 1.6: 1 -0.95,0; 2 0.95,0
TP20R = smd 2 x 2: TP 0,0
NCH8200HV = drill 1: 1 -7.62,7.62; 2 7.62,7.62 | drill 1 square: 3 -7.62,0; 4 7.62,-5.08
TEA5767 = smd 2.5 x 1.2: 1 -5.5,4; 2 -5.5,2; 3 -5.5,0; 4 -5.5,-2; 5 -5.5,-4; 6 5.5,-4; 7 5.5,-2; 8 5.5,0; 9 5.5,2; 10 5.5,4
RFPC-MMCX03-F = drill 0.8: 1 0,0; 2 1.27,1.27; 3 1.27,-1.27; 4 -1.27,-1.27; 5 -1.27,1.27
C0805 = smd 1.3 x 1.5: 1 -0.95,0; 2 0.95,0
CAPAE1030X1080N = smd 4.3 x 2.15: 1 -4.2,0; 2 4.2,0
SOD-323 = smd 0.63 x 0.83: A 1.15,0; C -1.15,0
FB805 = smd 1.3 x 1.5: 1 -0.85,0; 2 0.85,0
4_PAD_0.1" = drill 1.692 pad 2.54 long: 1 0,0; 2 0,-3.175; 3 0,-6.35; 4 0,-9.525
2_PAD_0.1" = drill 1.692 pad 2.54 long: 1 0,0; 2 0,-3.175
SOIC127P600X175-14N = smd 1.525 x 0.7: 1 -2.712,3.81; 2 -2.712,2.54; 3 -2.712,1.27; 4 -2.712,0; 5 -2.712,-1.27; 6 -2.712,-2.54; 7 -2.712,-3.81; 8 2.712,-3.81; 9 2.712,-2.54; 10 2.712,-1.27; 11 2.712,0; 12 2.712,1.27; 13 2.712,2.54; 14 2.712,3.81
2X3-NS = drill 1.016 pad 1.88: 1 -2.54,-1.27; 2 -2.54,1.27; 3 0,-1.27; 4 0,1.27; 5 2.54,-1.27; 6 2.54,1.27
204711-0001_MOL = smd 0.33 x 0.991: A1 -2.75,0.755; A2 -2.25,0.755; A3 -1.75,0.755; A4 -1.25,0.755; A5 -0.75,0.755; A6 -0.25,0.755; A7 0.25,0.755; A8 0.75,0.755; A9 1.25,0.755; A10 1.75,0.755; A11 2.25,0.755; A12 2.75,0.755; B1 2.75,-0.755; B2 2.25,-0.755; B3 1.75,-0.755; B4 1.25,-0.755; B5 0.75,-0.755; B6 0.25,-0.755; B7 -0.25,-0.755; B8 -0.75,-0.755; B9 -1.25,-0.755; B10 -1.75,-0.755; B11 -2.25,-0.755; B12 -2.75,-0.755 | smd 1.499 x 1.118: S_1 -3.1,2.15; S_2 3.1,2.15; S_3 -3.1,-2.15; S_4 3.1,-2.15 | drill 0.66 pad 0.66: S_1_H1 -2.921,2.159; S_1_H2 -3.302,2.159; S_2_H1 3.302,2.159; S_2_H2 2.921,2.159; S_3_H1 -2.921,-2.159; S_3_H2 -3.302,-2.159; S_4_H1 3.302,-2.159; S_4_H2 2.921,-2.159 | smd 1.245 x 0.864: S_5 -3.75,0; S_6 3.75,0 | drill 0.406 pad 0.406: S_5_H1 -3.556,0; S_5_H2 -3.937,0; S_6_H1 3.937,0; S_6_H2 3.556,0
0207ROUND = drill 1.016: 1 -2.54,0; 2 2.54,0
SML0805 = smd 1.2 x 1.2: A 1.05,0; C -1.05,0
IN-17 = drill 0.8: 0 2.777,4; 1 1.365,6; 2 -1.365,6; 3 -2.778,4; 4 -2.858,1.5; 5 -2.818,-1.143; 6 -2.778,-3.683; 7 -1.365,-5.683; 8 1.365,-5.683; 9 2.777,-3.683; A 2.777,1.5
INS-1 = drill 1.016 square: 1 -2.223,0; 2 2.223,0
SOT105P255X140-3N = smd 1.4 x 0.6: 1 -1.15,1.05; 2 -1.15,-1.05; 3 1.15,0
SW_KMR421GULCLFS = smd 0.9 x 1: 1 -2.05,0.8; 2 -2.05,-0.8; 3 2.05,-0.8; 4 2.05,0.8 | smd 1.7 x 0.55: 5 0,1.425
DIP762W46P254L2134H508Q16 = drill 0.813 long: 1 -3.81,8.89; 2 -3.81,6.35; 3 -3.81,3.81; 4 -3.81,1.27; 5 -3.81,-1.27; 6 -3.81,-3.81; 7 -3.81,-6.35; 8 -3.81,-8.89; 9 3.81,-8.89; 10 3.81,-6.35; 11 3.81,-3.81; 12 3.81,-1.27; 13 3.81,1.27; 14 3.81,3.81; 15 3.81,6.35; 16 3.81,8.89
SSOP28DB = smd 0.348 x 1.397: 1 -4.225,-3.656; 2 -3.575,-3.656; 3 -2.925,-3.656; 4 -2.275,-3.656; 5 -1.625,-3.656; 6 -0.975,-3.656; 7 -0.325,-3.656; 8 0.325,-3.656; 9 0.975,-3.656; 10 1.625,-3.656; 11 2.275,-3.656; 12 2.925,-3.656; 13 3.575,-3.656; 14 4.225,-3.656; 15 4.225,3.656; 16 3.575,3.656; 17 2.925,3.656; 18 2.275,3.656; 19 1.625,3.656; 20 0.975,3.656; 21 0.325,3.656; 22 -0.325,3.656; 23 -0.975,3.656; 24 -1.625,3.656; 25 -2.275,3.656; 26 -2.925,3.656; 27 -3.575,3.656; 28 -4.225,3.656
TEXAS_INSTRUMENTS_TPA3122D2N_0 = drill 0.9 pad 1.5 square: 1 -3.81,11.43 | drill 0.9 pad 1.5: 2 -3.81,8.89; 3 -3.81,6.35; 4 -3.81,3.81; 5 -3.81,1.27; 6 -3.81,-1.27; 7 -3.81,-3.81; 8 -3.81,-6.35; 9 -3.81,-8.89; 10 -3.81,-11.43; 11 3.81,-11.43; 12 3.81,-8.89; 13 3.81,-6.35; 14 3.81,-3.81; 15 3.81,-1.27; 16 3.81,1.27; 17 3.81,3.81; 18 3.81,6.35; 19 3.81,8.89; 20 3.81,11.43
PEC12R-4XXXF-SXXXX_1 = drill 1.2 pad 1.8: 1 -2.5,-7.5; 2 2.5,-7.5; 3 0,-7.5; 4 -2.5,7; 5 2.5,7 | drill 3.28 pad 4.8: 6 5.6,0; 7 -5.6,0
QFP50P1600X1600X120-100N = smd 1.5 x 0.35: 1 -8,6; 2 -8,5.5; 3 -8,5; 4 -8,4.5; 5 -8,4; 6 -8,3.5; 7 -8,3; 8 -8,2.5; 9 -8,2; 10 -8,1.5; 11 -8,1; 12 -8,0.5; 13 -8,0; 14 -8,-0.5; 15 -8,-1; 16 -8,-1.5; 17 -8,-2; 18 -8,-2.5; 19 -8,-3; 20 -8,-3.5; 21 -8,-4; 22 -8,-4.5; 23 -8,-5; 24 -8,-5.5; 25 -8,-6; 51 8,-6; 52 8,-5.5; 53 8,-5; 54 8,-4.5; 55 8,-4; 56 8,-3.5; 57 8,-3; 58 8,-2.5; 59 8,-2; 60 8,-1.5; 61 8,-1; 62 8,-0.5; 63 8,0; 64 8,0.5; 65 8,1; 66 8,1.5; 67 8,2; 68 8,2.5; 69 8,3; 70 8,3.5; 71 8,4; 72 8,4.5; 73 8,5; 74 8,5.5; 75 8,6 | smd 0.35 x 1.5: 26 -6,-8; 27 -5.5,-8; 28 -5,-8; 29 -4.5,-8; 30 -4,-8; 31 -3.5,-8; 32 -3,-8; 33 -2.5,-8; 34 -2,-8; 35 -1.5,-8; 36 -1,-8; 37 -0.5,-8; 38 0,-8; 39 0.5,-8; 40 1,-8; 41 1.5,-8; 42 2,-8; 43 2.5,-8; 44 3,-8; 45 3.5,-8; 46 4,-8; 47 4.5,-8; 48 5,-8; 49 5.5,-8; 50 6,-8; 76 6,8; 77 5.5,8; 78 5,8; 79 4.5,8; 80 4,8; 81 3.5,8; 82 3,8; 83 2.5,8; 84 2,8; 85 1.5,8; 86 1,8; 87 0.5,8; 88 0,8; 89 -0.5,8; 90 -1,8; 91 -1.5,8; 92 -2,8; 93 -2.5,8; 94 -3,8; 95 -3.5,8; 96 -4,8; 97 -4.5,8; 98 -5,8; 99 -5.5,8; 100 -6,8
6-WSON = smd 0.45 x 0.3: 1 -0.975,0.65; 2 -0.975,0; 3 -0.975,-0.65; 4 0.975,-0.65; 5 0.975,0; 6 0.975,0.65 | smd 1 x 1.6: 7 0,0 | drill 0.3 pad 0.5: 8 0,-0.508; 9 0,0.508
CRYSTAL-SMD-2X2.5MM = smd 1.2 x 1.1: P1 0.846,0.69; P2 -0.854,0.69; P3 -0.854,-0.71; P4 0.846,-0.71

### Placement (x,y rotation side)
5V  31.24,70.14 90 top
5V.  82.04,78.65 0 bottom
A1  18.8,60.23 270 bottom
A3  18.64,59.24 0 bottom
AE1  6.54,64.87 0 bottom
C1  33.4,81.19 270 top
C2  68.58,83.41 90 top
C3  38.23,81.19 90 top
C4  49.02,80.3 45 top
C5  56.52,83.92 0 bottom
C6  16.95,58.71 0 top
C7  14.73,15.47 225 top
C8  7.11,40.8 90 top
C9  18.86,35.03 45 bottom
C10  31.31,47.79 45 bottom
C11  13.21,16.99 225 top
C12  2.54,-3.9 0 top  (outside the outline)
C13  21.59,65.95 270 top
C14  24.89,66.01 270 top
C15  16.95,56.62 0 top
C16  65.47,82.4 0 top
C17  65.47,84.43 0 top
C18  3.17,56.11 90 top
C19  5.4,16.8 270 bottom
C20  5.46,18.39 270 top
C21  3.17,40.87 270 top
C22  7.11,48.42 90 top
C23  13.72,44.8 270 top
C24  16,44.8 270 top
C25  45.72,56.3 225 bottom
C28  35.05,78.01 225 bottom
C29  31.37,74.33 225 bottom
D1  31.43,81.44 90 top
D2  47.69,81.7 45 top
D3  28.26,67.66 270 bottom
FB1  51.05,83.41 135 top
GND.  78.87,81.82 0 bottom
H1  9.21,4.61 225 bottom
H3  18.22,13.56 225 bottom
IC1  14.86,46.26 0 bottom
J2  30.92,63.92 225 bottom
J3  48.13,80.68 45 bottom
L4  5.46,28.87 270 bottom
L5  6.43,6.6 90 top
LED1  26.1,77.38 135 bottom
LED2  64.9,75.09 180 bottom
LED3  61.02,75.09 0 bottom
N1  12.47,28.89 45 top
N2  25.04,41.46 45 top
N3  37.62,54.04 45 top
N4  57.38,73.8 45 top
NE1  51.13,60.29 45 top
Q1  56.58,67.16 225 bottom
R1  54.55,65.19 225 bottom
R2  20.51,50.07 0 bottom
R3  28.07,75.41 315 bottom
R4  64.58,76.24 135 top
R5  59.63,81.38 135 top
R6  47.24,57.82 225 bottom
R7  16.89,36.99 135 top
R8  28.7,48.61 135 top
R9  30.48,50.33 135 top
R10  53.59,67.73 315 top
R11  7.11,54.14 270 top
R12  7.05,58.96 90 top
R13  11.62,20.04 90 bottom
R14  2.29,24.74 0 top
R15  29.53,72.49 225 bottom
R16  30.99,78.33 135 bottom
R17  24.89,70.14 90 top
R18  62.29,83.35 90 top
R19  28.07,70.14 90 top
R20  21.59,70.14 270 top
R21  20.32,62.9 0 top
R22  20.32,60.81 0 top
R23  59.25,84.75 180 top
S1  40.32,82.78 315 bottom
U1  26.73,26.45 45 bottom
U2  64.01,80.62 180 bottom
U3  41.66,41.44 45 bottom
U4  56.71,56.49 45 bottom
U5  71.69,71.54 45 bottom
U6  5.14,48.74 0 bottom
U7  12.7,73.57 0 top
U8  42.16,69.38 135 bottom
U9  35.81,81.51 0 top
USBRX  35.69,56.17 0 bottom
USBTX  38.54,53.38 0 bottom
Y3  33.15,76.17 135 bottom

### Tracks (layer width: path | path; a pad name or v marks a point on that pad's centre or on a via)
5V  (via drill 0.3, 0.35)  (3 unrouted)
  Top 0.152: 18.17,63.45 16.69,64.93 14.71,64.93 13.87,65.77 13.87,66.6 12.64,67.83 11.2,67.83 A1.1 | 18.17,63.45 18.72,62.9 | 18.72,62.9 19.36,62.27 19.36,60.8 R22.1 20.93,59.24 22.64,59.24 22.99,58.89 22.99,55.79 v22.42,55.22 | 18.72,62.9 R21.1 | 18.17,63.45 20.66,65.95 23.16,65.95 23.89,66.67 23.89,67.85 24.92,68.88 24.92,69.05 R17.1 26.29,69.19 27.17,70.07 28.96,70.07 29.65,69.38 31.05,69.38 5V.1 31.14,69.09 30.1,68.05 v28.51,68.05 | D2.C 46.5,80.88 45.59,79.98 45.59,78.95 47.61,76.93 v47.65,76.93 | U5.5 73.49,65.33 61.02,52.87 58.53,52.87 U4.5 58.5,50.35 46,37.85 U3.5 43.45,35.3 31.02,22.86 U1.5 18.96,22.86 17.69,24.13 16.92,24.13 15.87,23.08 12.63,23.08 8.56,27.15 8.56,30.13 8.37,30.33 8.37,34.51 10.79,36.94 v10.79,47.47 | v41.08,62.08 41.15,62.14 v42.55,62.14
  Top 0.457: D1.C 31.43,73.24 32.46,72.22 32.46,70.28 31.37,69.19 5V.1 | v32.64,69.57 31.62,69.57 31.14,69.09
  Bottom 0.152: v47.65,76.93 47.65,76.3 47.11,75.76 U8.61 46.26,74.89 46.26,70.95 49.84,67.37 49.84,67.14 | A3.5 24.36,55.03 24.11,55.28 22.48,55.28 v22.42,55.22 21.46,54.26 R2.1 | 12.19,47.48 12.19,46.26 IC1.11 | 12.19,47.48 IC1.12 11.96,47.53 11.15,48.34 11.15,49.33 11.89,50.07 | A1.1 11.2,67.83 12.57,67.83 13.87,66.53 13.87,65.77 15.79,63.85 15.79,52.47 13.39,50.07 | 37.64,62.72 U8.10 38.41,63.5 | 49.84,67.14 50.06,67.14 50.6,66.61 U8.80 | 49.84,67.14 43.37,60.68 43.37,60.66 43.05,60.33 | U8.31 33.5,73.09 32.71,73.09 32.06,72.44 31.67,72.44 30.72,73.39 29.08,73.39 R15.1 | R15.1 28.75,73.06 28.75,71.81 30.95,69.61 32.6,69.61 v32.64,69.57 | v32.64,69.57 32.66,69.59 38.41,63.83 38.41,63.5 | D3.C 28.51,68.55 v28.51,68.05 | R3.2 28.86,73.28 R15.1 | v10.79,47.47 10.81,47.48 12.19,47.48 | U8.100 43.05,60.01 43.05,60.33 | v42.55,62.14 42.55,60.84 43.05,60.33 | v41.08,62.08 39.83,62.08 38.41,63.5 | v32.64,69.57 v32.65,69.58 32.65,70.41 U8.26 | U5.5 74.01,68.47 76.06,68.47 76.55,68.96 76.55,70.88 75.81,71.62 75.81,72.32 82.04,78.55 5V..TP
A1  (via drill 0.35)
  Top 0.152: v42.55,72.49 42.55,65.25 37.85,60.55 v37.53,60.55
  Bottom 0.152: U1.3 32.12,28.63 32.57,29.08 32.57,36.75 31.16,38.17 31.16,39.1 31.42,39.35 31.42,49.18 31.76,49.52 31.76,50.51 30.85,51.42 30.85,57.27 34.14,60.55 v37.53,60.55 | v42.55,72.49 42.55,76.74 44.45,78.65 44.36,78.65 U8.53
A2  (via drill 0.35)
  Top 0.152: v44.64,72.05 44.64,72.03 44.05,71.44 44.05,60.28 42.29,58.52 v42.29,58.01
  Bottom 0.152: U8.57 45.7,77.15 44.85,76.3 44.85,72.26 v44.64,72.05 | U3.3 46.85,41.63 46.85,51.63 42.29,56.19 v42.29,58.01
A3  (via drill 0.35)
  Top 0.152: v56.07,58.58 53.78,56.3 v53.72,56.3
  Bottom 0.152: 51.36,67.22 U8.78 52.01,66.6 52.01,63.95 50.45,62.38 50.45,59.64 53.72,56.36 v53.72,56.3 | v56.07,58.58 v56.07,58.57 58.16,56.49 U4.3
A4
  Bottom 0.152: U8.74 51.85,71.15 52.38,71.68 52.63,71.68 53.21,71.1 55.12,71.1 55.85,71.83 58.59,71.83 61.26,69.16 61.26,68.21 62.8,66.68 66.39,66.68 69.98,63.08 71.11,63.08 77.08,69.06 U5.3 | U5.3
B1  (via drill 0.35)
  Top 0.152: v43.12,71.98 42.86,71.73 42.86,65.14 37.75,60.02 37.31,60.02 36.43,60.9 36.43,61.72 v36.39,61.76
  Bottom 0.152: U1.6 26.73,24.1 31.9,29.27 31.9,36.55 30.87,37.58 29.68,37.58 29.2,38.07 29.2,38.75 29.68,39.24 30.44,39.24 30.8,39.6 30.8,49.43 31.15,49.78 31.15,50.22 30.24,51.13 30.24,57.52 34.48,61.76 v36.39,61.76 | v43.12,71.98 43.12,76.69 U8.54
B2  (via drill 0.35)
  Top 0.152: v42.93,57.57 42.93,58.65 44.45,60.17 44.45,71.09 v44.58,71.22
  Bottom 0.152: U8.58 45.21,75.95 45.21,71.85 v44.58,71.22 | v42.93,57.57 42.93,55.99 47.16,51.76 47.16,42.79 48.31,41.64 48.31,40.66 43.7,36.05 U3.6
B3
  Bottom 0.152: U8.77 52.32,67 52.32,63.82 50.75,62.26 50.75,61.5 52.31,59.94 52.81,59.94 54.57,58.18 54.57,51.01 53.64,50.08 53.64,49.39 54.99,48.03 55.69,48.03 56.18,48.53 56.18,50.57 U4.6
B4
  Bottom 0.152: U8.73 51.49,71.5 52.02,72.03 52.71,72.03 53.34,71.4 54.99,71.4 55.73,72.13 58.72,72.13 61.57,69.28 62.92,69.28 64.34,67.86 69.98,67.86 U5.6
C1  (via drill 0.35)
  Top 0.152: v43.69,73 43.28,73 42.95,73.33 42.2,73.33 41.71,72.84 41.71,68.16 v35.88,62.33
  Bottom 0.152: U1.7 24.94,22.79 31.59,29.45 31.59,35.35 29.7,37.25 29.59,37.25 28.89,37.94 28.89,38.88 30.48,40.47 30.48,49.54 30.84,49.9 30.84,50.09 29.94,51 29.94,57.65 34.62,62.33 v35.88,62.33 | v43.69,73 43.69,76.56 U8.55
C2  (via drill 0.35)
  Top 0.152: v45.34,71.22 45.15,71.03 45.14,71.03 44.87,70.76 44.87,60.15 43.5,58.77 v43.5,58.08
  Bottom 0.152: U8.59 45.51,75.55 45.51,71.41 45.34,71.23 v45.34,71.22 | U3.7 42.4,34.25 48.76,40.61 48.76,41.63 47.53,42.86 47.53,51.82 43.5,55.85 v43.5,58.08
C3
  Bottom 0.152: U8.76 52.62,67.41 52.62,63.69 51.06,62.13 51.06,61.64 52.45,60.25 53.03,60.25 54.91,58.37 U4.7
C4
  Bottom 0.152: U8.72 51.14,71.85 51.67,72.38 52.79,72.38 53.46,71.7 54.87,71.7 55.6,72.44 58.84,72.44 61.7,69.58 63.05,69.58 64.47,68.17 70.86,68.17 72.96,66.07 72.96,65.37 72.37,64.78 70.33,64.78 U5.7
D1  (via drill 0.35)
  Top 0.152: v43.88,72.17 43.68,72.17 42.83,73.02 42.33,73.02 42.01,72.71 42.01,72.26 42.24,72.03 42.24,65.39 37.97,61.12 v36.96,61.12
  Bottom 0.152: U1.4 30.33,27.26 32.24,29.18 32.24,36.65 30.86,38.04 30.86,39.22 31.11,39.48 31.11,49.31 31.45,49.65 31.45,50.35 30.55,51.25 30.55,57.39 34.28,61.12 v36.96,61.12 | v43.88,72.17 44.26,72.55 44.26,76.42 U8.56
D2  (via drill 0.35)
  Top 0.152: v45.4,70.46 45.21,70.27 45.21,60.04 44.13,58.96 v44.13,57.63
  Bottom 0.152: v45.4,70.46 45.4,70.53 45.87,71 45.87,75.21 U8.60 | v44.13,57.63 44.03,57.74 44.03,58.3 43.72,58.61 42.13,58.61 41.76,58.23 41.76,56.26 46.52,51.5 46.52,42.97 45.28,41.73 45.28,39.67 U3.4
D3
  Bottom 0.152: U8.75 52.07,69.37 55.13,66.31 55.13,65.77 51.36,62 51.36,61.79 52.61,60.55 53.25,60.55 59.11,54.69 U4.4
D4
  Bottom 0.152: U8.71 50.79,72.21 51.31,72.74 52.86,72.74 53.59,72.01 54.74,72.01 55.47,72.74 58.97,72.74 61.82,69.89 63.18,69.89 64.59,68.47 71.89,68.47 73.16,69.74 U5.4
ENCODERA  (via drill 0.35)
  Top 0.152: C13.1 21.64,66.94 21.64,69.12 R20.2 23.24,67.54 v23.24,67.28
  Bottom 0.152: U8.23 32.44,66.73 31.63,66.73 30.57,67.78 29.01,67.78 v28.51,67.28 v23.24,67.28
ENCODERB  (via drill 0.35)
  Top 0.152: 25.07,66.69 C14.1 27.13,69.2 28.04,69.2 R19.1 28.89,69.19 29.27,68.81 v29.72,68.81
  Bottom 0.152: U8.24 32.48,67.61 31.95,67.08 31.76,67.08 30.04,68.81 v29.72,68.81
ENCODERSW
  Bottom 0.152: U7.4 10.2,80.66 11.28,81.74 17.54,81.74 31.44,67.84 32.14,67.84 U8.25
GND  (via drill 0.35)  (76 unrouted)
  Top 0.152: C3.2 38.17,82.14
  Top 0.381: U9.5 37.54,81.51 38.17,82.14
  other vias: 44.77,58.58 43.43,80.55 41.78,80.62 20.07,64.3 47.43,54.58 45.78,59.66
  pour Top (rank 2): -0.64,3.08 3.17,-0.73 9.53,-0.73 88.22,77.97 84.52,86.9 -0.64,86.9
  pour Bottom: -0.64,3.08 3.17,-0.73 9.53,-0.73 88.22,77.97 84.52,86.9 -0.64,86.9
INS-1  (via drill 0.3, 0.35)
  Top 0.152: v46.79,73.63 46.28,74.14 37.34,74.14 v36.32,73.12
  Bottom 0.152: v36.32,73.12 36.07,73.38 36.05,73.38 35.51,73.93 U8.35 | R1.1 53.88,66.72 46.97,73.63 v46.79,73.63
L  (via drill 0.3)
  Top 0.152: v16,42.59 C24.2
  Bottom 0.152: v16,42.59 16.03,42.59 17.11,43.67 17.53,43.67 IC1.6
LPOT  (via drill 0.35)
  Top 0.152: C6.2 v22.42,58.71
  Bottom 0.152: v22.42,58.71 22.42,58.21 16.27,52.07 16.27,46.12 17.41,44.99 IC1.5
MISO
  Bottom 0.152: J2.1 30.28,66.36 32.78,66.36 U8.22
MOSI  (via drill 0.35)
  Top 0.152: J2.4 30.03,64.8 v30.04,64.81
  Bottom 0.152: IC1.3 18.26,48.23 21.86,48.23 29.26,55.63 29.26,62.26 J2.4 | U8.21 33.14,66.01 31.33,66.01 30.13,64.81 v30.04,64.81
N$1  (via drill 0.35)
  Top 0.152: v47.62,78.78 48.35,79.5 C4.1 48.35,81.17 49.93,82.75 51.59,82.75 FB1.1
  Bottom 0.152: J3.B9 48,78.78 v47.62,78.78
N$2
  Bottom 0.152: NE1.2 53.94,61.86 57.39,65.32 Q1.3
N$3
  Bottom 0.152: R6.2 49.48,58.71 NE1.1
N$4
  Bottom 0.152: U2.2 60.44,84.81 60.05,85.2 58.75,85.2 C5.1
N$5  (via drill 0.3)
  Top 0.152: C2.1 67.12,81 v67.03,81
  Bottom 0.152: U2.17 66.94,76.97 66.94,80.91 v67.03,81
N$6
  Bottom 0.152: LED1.A 28.74,76.22 R3.1
N$7  (via drill 0.35)
  Top 0.152: v49.28,83.09 49.24,83.13 | 49.24,83.13 48.63,82.51 D2.A | C17.1 C16.1 64.45,82.33 64.45,82.14 v63.12,80.81 | FB1.2 50.13,84.01 49.24,83.13
  Bottom 0.152: U2.4 61.74,83.86 61.74,82.78 | U2.20 64.98,78.96 v63.12,80.81 | 61.74,82.78 61.74,82.2 v63.12,80.81 | v63.12,80.81 | v49.28,83.09 49.44,82.93 59.23,82.93 59.6,82.56 61.52,82.56 61.74,82.78
N$8
  Top 0.152: U9.2 U9.1 33.42,82.16 C1.1 32.95,82.59 D1.A
  pour Top (no thermals): 30.67,82.97 33.27,82.97 33.97,82.27 34.99,82.27 34.99,81.38 30.67,81.38
N$9
  Bottom 0.152: Q1.1 55.66,66.59 55.66,64.96 R1.2
N$10
  Top 0.152: U1.15 26.04,33.64 22.6,30.21 13.09,30.21 N1.1
N$11  (via drill 0.3)
  Top 0.152: v68.14,80.92 68.12,80.91 68.12,80.33 66.9,79.11 57.27,79.11 56.55,79.83 53.69,79.83 52.59,78.74 49.34,78.74 48.35,77.75 47.28,77.75 46.1,78.93 v46.1,79.77
  Bottom 0.152: v46.1,79.77 46.76,79.77 47.32,80.32 J3.B6 | v68.14,80.92 68.14,77.06 U2.15
N$12  (via drill 0.3)
  Top 0.152: v46.86,79.18 v46.85,79.17 46.85,78.61 47.4,78.06 48.22,78.06 49.21,79.04 52.46,79.04 53.56,80.14 56.74,80.14 57.47,79.41 66.49,79.41 v67.55,80.48
  Bottom 0.152: U2.16 67.55,76.99 v67.55,80.48 | J3.B7 47.71,80.03 v46.86,79.18
N$13  (via drill 0.35)
  Top 0.152: R18.1 60.51,82.4 v59.82,83.09
  Bottom 0.152: U2.1 59.78,83.13 v59.82,83.09
N$14
  Top 0.152: U1.8 19.04,21.58 13.22,21.58 7.95,26.85 7.95,28.32 6.85,29.41 6.85,31.76 N1.2
N$15
  Top 0.152: U1.9 17.67,22.77 12.51,22.77 8.25,27.03 8.25,29.18 N1.3
N$16
  Top 0.152: U1.13 24.41,29.52 16.7,29.52 12.45,25.26 10.94,25.26 9.39,26.82 N1.4
N$17
  Top 0.152: U1.14 24.68,31.84 22.67,29.83 16.55,29.83 12.81,26.09 N1.5
N$18
  Top 0.152: N1.6 13.14,24.32 13.81,24.99 17.84,24.99 18.77,25.93 20.82,25.93 U1.11
N$19
  Top 0.152: U1.10 16.3,24.66 15.55,23.91 N1.7
N$20
  Top 0.152: U1.1 35.7,30.03 30.98,30.03 27.93,26.98 23.2,26.98 21.1,29.08 16.7,29.08 16.21,28.59 16.21,27.91 17.45,26.66 N1.8
N$21
  Top 0.152: U1.2 33.9,28.23 29.65,28.23 28.1,26.67 23.07,26.67 21.49,28.25 N1.9
N$22
  Top 0.152: N1.0 11.59,33.67 11.59,32.18 13.27,30.51 22.48,30.51 26.87,34.91 29.8,34.91 U1.16
N$23
  Top 0.152: N1.A 17.55,36.09 R7.1
N$24
  Top 0.152: U3.15 42.94,48.11 40.15,48.11 37.72,45.68 32.39,45.68 30,43.29 25.15,43.29 N2.1
N$25
  Top 0.152: N2.2 19.42,44.32 19.42,40.86 24.87,35.41 28.25,35.41 29.55,36.7 30.24,36.7 34.49,32.46 U3.8
N$26
  Top 0.152: N2.3 20.25,40.46 25,35.71 26.16,35.71 27.76,37.31 32.14,37.31 U3.9
N$27
  Top 0.152: N2.4 28.09,40.5 32.62,45.03 U3.13
N$28
  Top 0.152: N2.5 22.63,38.66 21.14,40.16 21.14,40.85 21.62,41.33 28.48,41.33 32.49,45.34 37.86,45.34 39.34,46.81 41.64,46.81 U3.14
N$29
  Top 0.152: N2.6 28.04,39.25 31.47,39.25 33.66,41.44 U3.11
N$30
  Top 0.152: N2.7 28.89,36.48 29.42,37.01 32.27,37.01 32.7,36.58 33.45,36.58 34.47,37.59 U3.10
N$31
  Top 0.152: N2.8 31.07,38.41 33.57,40.91 35.34,40.91 36.08,40.17 42.27,40.17 47.13,45.03 U3.1
N$32
  Top 0.152: N2.9 29.61,41.57 32.72,44.68 34.28,44.68 38.45,40.5 42.17,40.5 47.97,46.3 50.62,46.3 51.97,44.95 51.97,44.25 50.95,43.23 U3.2
N$33  (via drill 0.35)
  Top 0.152: v37.66,46.39 37.26,46 32.21,46 29.87,43.66 25.6,43.66 24.18,45.08 N2.0
  Bottom 0.152: U3.16 45.25,48.26 42.55,45.56 41.1,45.56 40.27,46.39 v37.66,46.39
N$34
  Top 0.152: N2.A 29.37,47.91 R8.1
N$35
  Top 0.152: U4.15 58.48,63.65 52.18,63.65 45.04,56.52 41.28,56.52 40.63,55.87 37.72,55.87 N3.1
N$36  (via drill 0.35)
  Top 0.152: N3.2 32.35,57.31 32,56.96 32,53.64 37.3,48.34 38.73,48.34 40.13,49.74 v40.13,50.01 | v41.21,50.01 41.23,50.03 42.82,50.03 43.43,50.64 43.43,50.65 44.47,51.69 46.85,51.69 47.63,50.91 49.71,50.91 U4.8
  Bottom 0.152: v40.13,50.01 v41.21,50.01
N$37  (via drill 0.35)
  Top 0.152: U4.9 47.73,53.25 46.02,54.95 42.14,54.95 41.05,53.87 41.05,51.12 v41.21,50.96 | v40.13,50.96 39.56,50.39 39.56,49.6 38.6,48.64 37.43,48.64 32.82,53.25 N3.3
  Bottom 0.152: v41.21,50.96 v40.13,50.96
N$38
  Top 0.152: U4.13 49.49,60.08 45.31,55.91 41.72,55.91 37.26,51.45 37.26,50.89 36.78,50.41 36.09,50.41 34.54,51.96 N3.4
N$39
  Top 0.152: N3.5 41.41,56.21 45.19,56.21 52.31,63.34 55.24,63.34 U4.14
N$40
  Top 0.152: N3.6 38.27,49.48 38.27,52.02 41.84,55.6 48.27,55.6 49.16,56.49 U4.11
N$41
  Top 0.152: N3.7 40.67,53.99 41.95,55.27 48.94,55.27 U4.10
N$42
  Top 0.152: N3.8 42.6,51.81 41.36,53.05 41.36,53.74 41.84,54.23 42.53,54.23 43.01,53.74 43.01,53.49 44.14,52.37 47.03,52.37 47.77,51.63 51.29,51.63 59.72,60.06 65.67,60.06 U4.1
N$43
  Top 0.152: N3.9 43.52,52.06 46.91,52.06 47.65,51.32 51.41,51.32 58.38,58.28 U4.2
N$44
  Top 0.152: U4.16 53.5,65.47 44.85,56.82 41.16,56.82 40.57,56.23 38.18,56.23 36.75,57.66 N3.0
N$45
  Top 0.152: N3.A 38.52,58.23 36.68,60.07 33.94,60.07 31.58,57.72 31.58,53.53 32.85,52.26 32.85,51.36 R9.1
N$46
  Top 0.152: U5.15 67.45,78.72 67.2,78.47 57.62,78.47 56.91,77.76 55.34,77.76 N4.1
N$47
  Top 0.152: N4.2 51.54,76.44 51.54,73.33 57.25,67.61 59.38,67.61 64.44,62.56 U5.8
N$48
  Top 0.152: N4.3 52.59,72.73 57.37,67.95 U5.9
N$49
  Top 0.152: U5.13 67.84,75.13 66.7,73.99 55.45,73.99 N4.4
N$50
  Top 0.152: N4.5 54.97,70.99 53.47,72.49 53.47,73.18 54.59,74.3 66.57,74.3 69.18,76.91 71.67,76.91 U5.14
N$51
  Top 0.152: N4.6 59.61,69.23 60.07,69.7 62.48,69.7 63.19,70.4 63.19,70.54 64.19,71.54 U5.11
N$52
  Top 0.152: N4.7 60.43,68.86 60.79,69.21 63.98,69.21 U5.10
N$53
  Top 0.152: N4.8 62.37,70.75 62.84,70.75 64.89,72.81 66.23,72.81 67.56,71.47 71.54,71.47 76.13,76.06 79.74,76.06 U5.1
N$54
  Top 0.152: N4.9 66.33,73.16 67.67,71.81 71.44,71.81 76.03,76.4 80.59,76.4 81.94,75.05 81.94,74.35 80.92,73.33 U5.2
N$55
  Top 0.152: N4.0 56.7,78.78 67.06,78.78 68.77,80.49 75.26,80.49 U5.16
N$56
  Top 0.152: R10.1 52.92,71.49 51.23,73.18 51.23,77.31 51.83,77.9 52.64,77.9 53.72,76.82 N4.A
N$57  (via drill 0.35)
  Top 0.152: v66.99,75.79 65.48,75.79 R4.1
  Bottom 0.152: 65.91,75.07 LED2.A 66.64,75.79 v66.99,75.79
N$58
  Top 0.152: C8.1 7.13,39.84 U6.9
N$59
  Bottom 0.457: A3.10 10.16,63.24 8.53,64.87 AE1.1
N$60
  Top 0.152: U6.3 R11.1
N$61
  Top 0.152: U6.2 8.57,58.01 R12.1
N$62  (via drill 0.35)
  Top 0.152: R23.1 60.89,85.44 v62.36,85.44
  Bottom 0.152: U2.5 62.38,85.42 v62.36,85.44
N$63
  Top 0.711: U6.19 2.6,57.63 C18.2
  Bottom 0.457: U6.19 3.17,55.79 3.17,33.69 L4.1
N$64
  Top 0.152: C18.1 1.4,55.16 U6.18
N$65
  Bottom 0.457: C19.2 11.14,6.85 H1.2
N$66
  Top 0.457: C20.1 5.36,22.49 | 5.36,22.49 4,21.13 4,11.56 L5.2 | R14.2 5.36,22.61 5.36,22.49
N$67
  Top 0.457: C20.2 8.07,11.58 11.22,11.58 | H1.3 12.8,10 11.22,11.58 | 11.22,11.58
N$68
  Top 0.152: C21.1 2.6,42.39 U6.13
N$69
  Bottom 0.152: U2.22 63.68,75.26 LED2.C
N$70
  Top 0.152: C22.1 U6.6
N$71
  Top 0.152: U6.5 12.35,50.01 13.72,48.65 C23.1
N$72
  Top 0.152: U6.4 11.18,50.33 12.51,50.33 14.07,48.77 14.07,46.91 C24.1
N$73
  Bottom 0.457: L4.2 5.4,26.26 C19.1 R13.2
N$74
  Top 0.457: C21.2 1.4,39.92 U6.12
  Bottom 0.457: U6.12 1.34,39.85 2.46,38.73 2.46,8.02 L5.1
N$75
  Bottom 0.152: U2.23 63.03,76.28 62.41,75.65 62.41,75.43 LED3.C
N$76
  Bottom 0.152: U8.98 44.28,60.15 45.3,59.13 45.3,57.22 C25.1
N$78
  Top 0.152: R17.2 24.84,71.11 21.64,71.11 R20.1 21.57,71.03 21.55,71.03 20.94,70.42 12.09,70.42 10.08,68.41 10.08,66.19 U7.1
N$79  (via drill 0.3)
  Top 0.152: R5.1 59.51,79.92 v59.28,79.92
  Bottom 0.152: v59.28,79.92 59.23,79.87 59.23,75.96 59.91,75.28 LED3.A
N$80
  Top 0.152: 5V.2 31.24,71.11 28.12,71.11 R19.2 28.04,71.03 26.67,71.03 25.76,70.12 19.02,70.12 15.2,66.29 U7.2
N$83  (via drill 0.3)
  Top 0.152: C6.1 15.43,58.71 v14.87,59.27
  Bottom 0.152: v14.87,59.27 13.17,59.27 A3.8
N$84  (via drill 0.3)
  Top 0.152: C15.1 15.43,56.62 v14.83,57.21
  Bottom 0.152: A3.7 13.22,57.01 13.34,57.01 13.54,57.21 v14.83,57.21
N$85
  Bottom 0.152: D3.A 28.26,64.84 J2.2
R  (via drill 0.3)
  Top 0.152: v13.68,42.62 13.68,43.85 C23.2
  Bottom 0.152: v13.68,42.62 13.68,42.7 12.65,43.72 IC1.9
RESET  (via drill 0.35)
  Top 0.152: J2.5 35.18,64.58 35.18,70.65 34.92,70.9 v34.92,71.09 35.18,71.35 35.18,73.63 40.03,78.48 40.03,82.17 v40.07,82.21 43.13,85.27 47.88,85.27 48.64,84.5 v48.64,84.49
  Bottom 0.152: R15.2 31.91,71.82 32.82,72.74 33.14,72.74 33.67,72.21 U8.30 34.79,71.09 v34.92,71.09 | C5.2 54.49,85 49.15,85 v48.64,84.49 | v40.07,82.21 40.07,81.15 S1.3
RPOT  (via drill 0.35)
  Top 0.152: C15.2 17.97,56.68 v19.37,56.68
  Bottom 0.152: IC1.10 12.31,44.99 13.22,45.9 13.22,49.45 19.37,55.6 v19.37,56.68
SCK
  Bottom 0.152: IC1.2 17.82,48.55 21.75,48.55 28.86,55.66 28.86,63.5 29.54,64.19 31.2,64.19 J2.3 32.65,64.82 U8.20
SCL  (via drill 0.3, 0.35)
  Top 0.152: R22.2 21.27,60.89 21.65,61.28 v22.42,61.28 | v22.42,61.28 | v22.42,61.28 24.07,59.62 32.31,59.62 35.8,63.12 35.8,73.32 38.27,75.79 v39.18,75.79
  Bottom 0.152: A3.2 24.11,61.28 v22.42,61.28 | U8.43 39.18,75.9 v39.18,75.79
SDA  (via drill 0.3, 0.35)
  Top 0.152: R21.2 21.63,63.26 v22.45,63.26 25.78,59.93 32.18,59.93 35.5,63.25 35.5,73.45 38.41,76.36 v39.69,76.36
  Bottom 0.152: A3.1 22.47,63.24 v22.45,63.26 | U8.44 39.42,76.36 v39.69,76.36
SS
  Bottom 0.152: U8.19 33.63,65.08 33.63,64.9 29.63,60.91 29.63,55.57 21.98,47.92 19.39,47.92 18.43,46.96 16.71,46.96 16.58,47.09 16.58,49.25 17.41,50.07 IC1.1 R2.2
USBRX  (via drill 0.35)
  Top 0.152: R23.2 57.85,84.75 v57.15,85.44
  Bottom 0.152: 42.44,81.93 46.13,85.62 56.97,85.62 v57.15,85.44 | 42.44,81.93 42.37,81.85 42.37,77.43 41.91,76.97 41.91,73.04 41.67,72.79 41.67,61.81 U8.3 36.02,56.17 USBRX.TP | 42.44,81.93
USBTX  (via drill 0.35)
  Top 0.152: R18.2 61.7,83.72 57.42,83.72 56.45,84.68 v56.45,85.06
  Bottom 0.152: v56.45,85.06 56.45,85.13 56.26,85.32 46.26,85.32 42.67,81.73 42.67,77.3 42.24,76.87 42.24,72.94 41.97,72.67 41.97,61.41 U8.2 39.83,59.26 39.55,59.26 37.69,57.4 37.69,54.23 USBTX.TP
V_BATT  (via drill 0.35)
  Top 0.152: R12.2 8.7,59.91 U6.1 | v36.77,82.78 36.79,82.75
  Top 0.381: C3.1 38.23,80.31 37.68,80.86 U9.4 36.79,80.26 v36.77,80.24
  Top 0.457: C7.1 16.26,16.99 16.26,17.44 | v32.19,46.9 v29.53,44.23 | 36.79,82.75 U9.6
  Top 0.61: 36.79,83.65 U9.6
  Top 0.711: 4.67,61.03 3.98,61.71 3.98,76.4 11.23,83.65 36.79,83.65 | 5.13,37.5 5.13,46.21 U6.16 U6.17 2.41,53.63 3.77,53.63 4.67,54.53 4.67,61.03 | 5.13,37.5 5.13,32.9 4.1,31.86 4.1,29.48 6.79,26.79 6.79,25.9 13.88,18.81 | U6.10 5.32,37.31 5.13,37.5 | 14.96,18.74 16.26,17.44 17.46,16.24 20.03,16.24 H3.2 | C11.1 13.88,18.81 | 14.89,18.81 14.96,18.74 | 14.96,18.74 13.95,18.74 13.88,18.81 | 4.67,61.03 8.1,61.03 U6.1
  Bottom 0.457: H3.2 14.54,21.73 14.54,24.37 21.83,31.65 C9.1 21.83,34.43 29.53,42.13 v29.53,44.23 | C10.1 v32.2,46.9 v32.19,46.9 | v36.77,82.78 v36.77,80.24
VCC_1  (via drill 0.35)
  Top 0.152: A1.2 16.98,46.81 16.98,46.68 | R7.2 16.98,38.43 16.98,46.68 | 19.58,49.29 | 19.58,49.29 R8.2 | R8.2 29.75,51 R9.2 | v44.32,52.93 v45.78,54.39 | v31.88,52.04 30.85,52.04 R9.2 | R8.2 28.09,49.29 R9.2 | R9.2 | R8.2 19.58,49.29 | R8.2 | 19.58,49.29 16.98,46.68 | R10.2 53.72,66.51 53.11,66.51 51.37,68.24 51.37,71.24 45.29,77.32 45.29,80.33 49.17,84.21 49.17,84.71 48.31,85.57 42.68,85.57 39.47,82.36 39.47,79.76 39.07,79.36 32.56,79.36 32.12,79.79 32.12,81.36 32.01,81.47 30.92,81.47 30.76,81.31 30.76,80.05 23.19,72.48 20.93,72.48 19.2,70.75 11.99,70.75 9.07,67.83 9.07,65.01 14.09,59.99 14.09,49.57 16.98,46.68
  Bottom 0.152: v45.78,54.39 45.17,55 45.17,55.84 46.64,57.3 46.64,58.43 R6.1 | v31.88,52.04 31.9,52.07 43.46,52.07 v44.32,52.93
XTAL1
  Bottom 0.152: U8.34 35.08,73.64 34.44,74.29 34.44,76.08 Y3.P1 34.38,76.43 C28.1 34.06,79 R16.2
XTAL2
  Bottom 0.152: R16.1 30.51,77.47 30.51,75.19 C29.1 31.77,76.07 Y3.P3 32.1,76.13 33.15,76.13 34.07,75.21 34.07,73.91 34.72,73.27 U8.33

### Text on the board
bNames: Nixie Radio v1.1 | B+ | B- | R- | R+ | L+ | L-